# EAGLE design Lyra_Main_4_Panel (EAGLE 9.6.0)
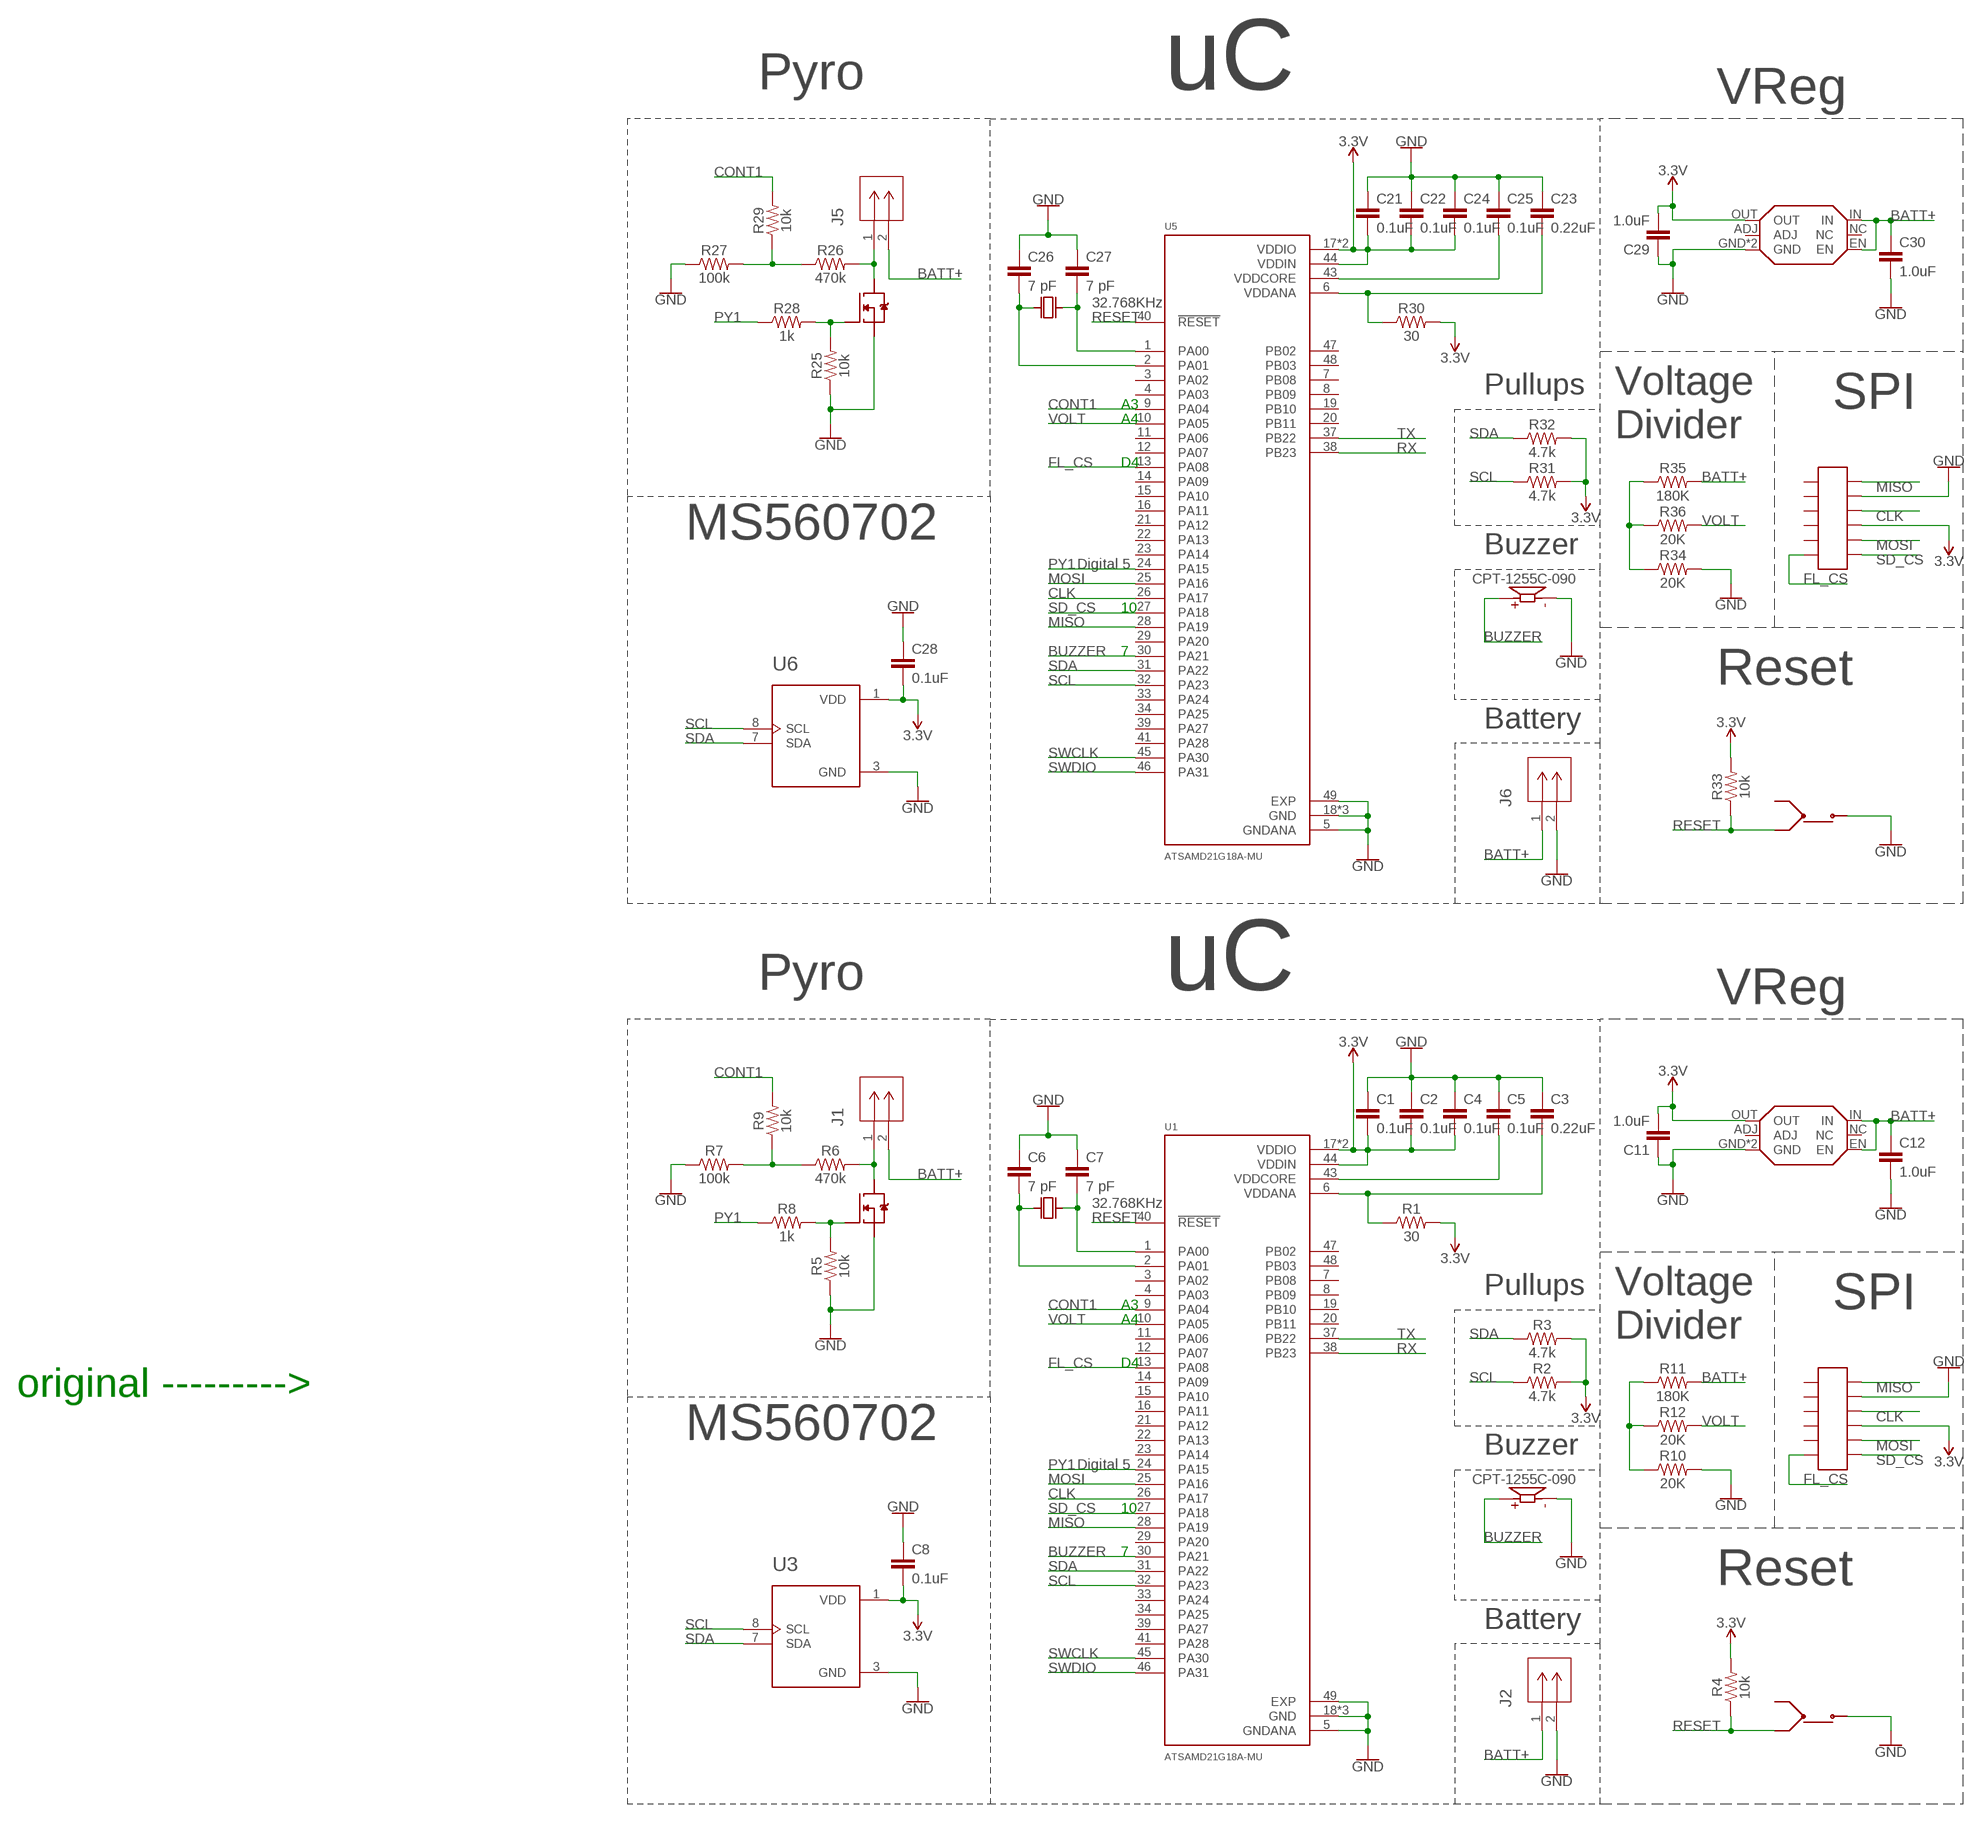
[diagram p0: schematic, sheet 1, part 1 of 2]
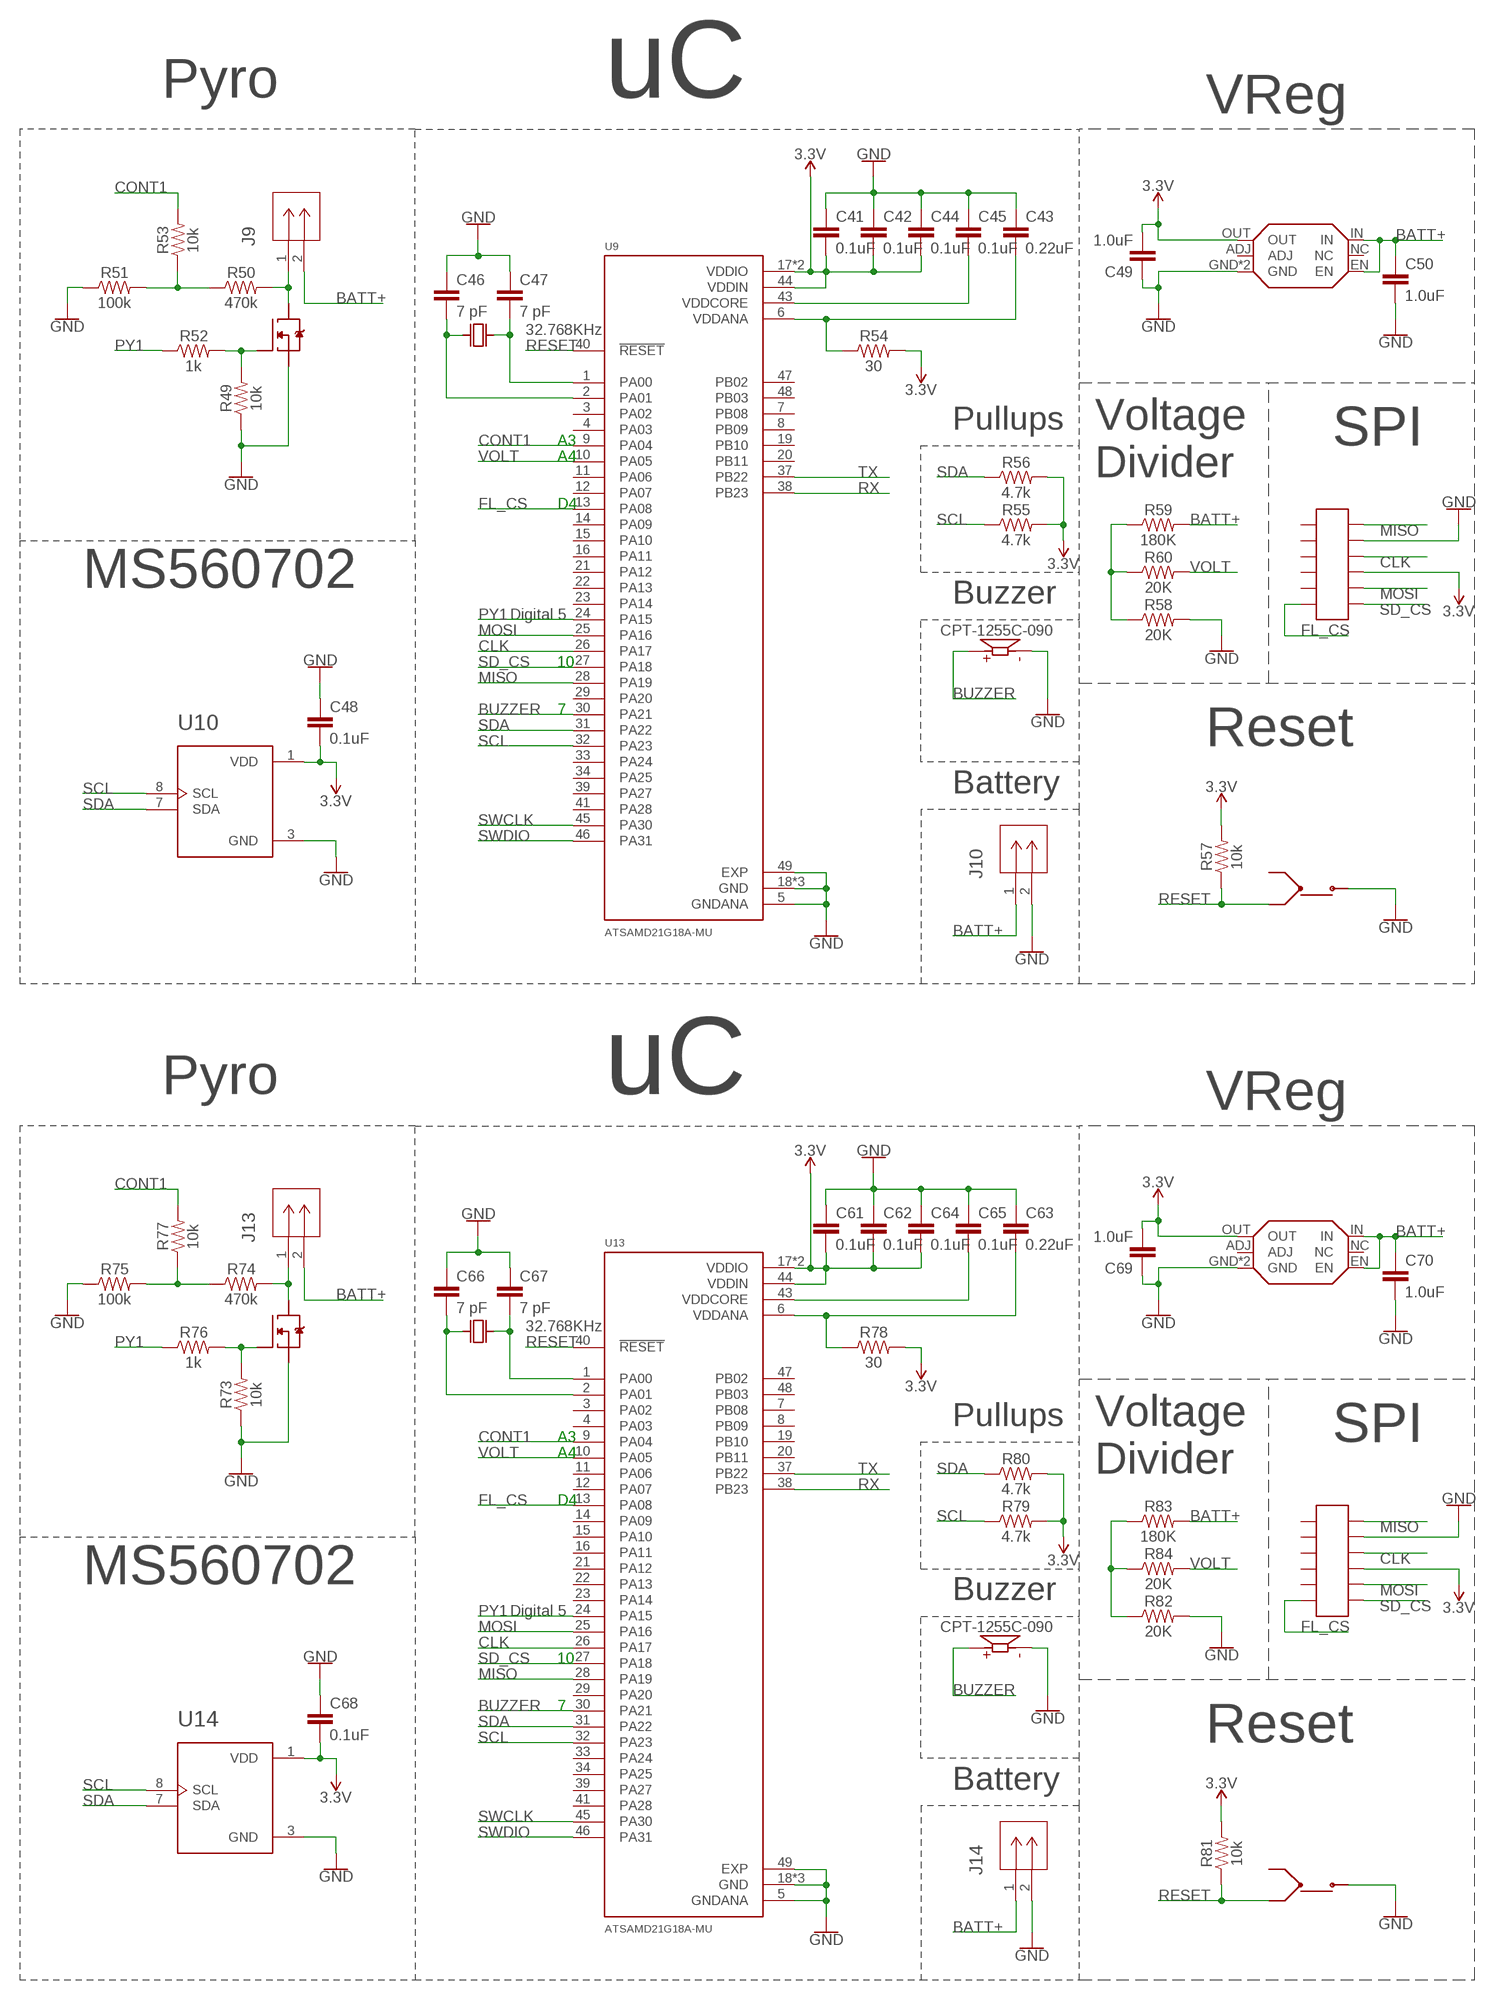
[diagram p1: schematic, sheet 1, part 2 of 2]

## Parts
C1  0.1uF  0.1UF-0603-25V-(+80/-20%)  [0603]
C2  0.1uF  0.1UF-0603-25V-(+80/-20%)  [0603]
C3  0.22uF  0.1UF-0603-25V-(+80/-20%)  [0603]
C4  0.1uF  0.1UF-0603-25V-(+80/-20%)  [0603]
C5  0.1uF  0.1UF-0603-25V-(+80/-20%)  [0603]
C6  7 pF  0.1UF-0402-16V-10%  [0402]
C7  7 pF  0.1UF-0402-16V-10%  [0402]
C8  0.1uF  0.1UF-0603-25V-(+80/-20%)  [0603]
C11  1.0uF  1.0UF-0402-16V-10%  [0402]
C12  1.0uF  1.0UF-0402-16V-10%  [0402]
C21  0.1uF  0.1UF-0603-25V-(+80/-20%)  [0603]
C22  0.1uF  0.1UF-0603-25V-(+80/-20%)  [0603]
C23  0.22uF  0.1UF-0603-25V-(+80/-20%)  [0603]
C24  0.1uF  0.1UF-0603-25V-(+80/-20%)  [0603]
C25  0.1uF  0.1UF-0603-25V-(+80/-20%)  [0603]
C26  7 pF  0.1UF-0402-16V-10%  [0402]
C27  7 pF  0.1UF-0402-16V-10%  [0402]
C28  0.1uF  0.1UF-0603-25V-(+80/-20%)  [0603]
C29  1.0uF  1.0UF-0402-16V-10%  [0402]
C30  1.0uF  1.0UF-0402-16V-10%  [0402]
C41  0.1uF  0.1UF-0603-25V-(+80/-20%)  [0603]
C42  0.1uF  0.1UF-0603-25V-(+80/-20%)  [0603]
C43  0.22uF  0.1UF-0603-25V-(+80/-20%)  [0603]
C44  0.1uF  0.1UF-0603-25V-(+80/-20%)  [0603]
C45  0.1uF  0.1UF-0603-25V-(+80/-20%)  [0603]
C46  7 pF  0.1UF-0402-16V-10%  [0402]
C47  7 pF  0.1UF-0402-16V-10%  [0402]
C48  0.1uF  0.1UF-0603-25V-(+80/-20%)  [0603]
C49  1.0uF  1.0UF-0402-16V-10%  [0402]
C50  1.0uF  1.0UF-0402-16V-10%  [0402]
C61  0.1uF  0.1UF-0603-25V-(+80/-20%)  [0603]
C62  0.1uF  0.1UF-0603-25V-(+80/-20%)  [0603]
C63  0.22uF  0.1UF-0603-25V-(+80/-20%)  [0603]
C64  0.1uF  0.1UF-0603-25V-(+80/-20%)  [0603]
C65  0.1uF  0.1UF-0603-25V-(+80/-20%)  [0603]
C66  7 pF  0.1UF-0402-16V-10%  [0402]
C67  7 pF  0.1UF-0402-16V-10%  [0402]
C68  0.1uF  0.1UF-0603-25V-(+80/-20%)  [0603]
C69  1.0uF  1.0UF-0402-16V-10%  [0402]
C70  1.0uF  1.0UF-0402-16V-10%  [0402]
J1  OSTVN02A150  [CONN_OSTVN02A150_OST]
J2  OSTVN02A150  [CONN_OSTVN02A150_OST]
J5  OSTVN02A150  [CONN_OSTVN02A150_OST]
J6  OSTVN02A150  [CONN_OSTVN02A150_OST]
J9  OSTVN02A150  [CONN_OSTVN02A150_OST]
J10  OSTVN02A150  [CONN_OSTVN02A150_OST]
J13  OSTVN02A150  [CONN_OSTVN02A150_OST]
J14  OSTVN02A150  [CONN_OSTVN02A150_OST]
LS2  CPT-1255C-090  [CUI_CPT-1255C-090]
LS3  CPT-1255C-090  [CUI_CPT-1255C-090]
LS5  CPT-1255C-090  [CUI_CPT-1255C-090]
LS7  CPT-1255C-090  [CUI_CPT-1255C-090]
R1  30  RESISTOR0402  [0402]
R2  4.7k  4.7KOHM-0603-1/10W-1%  [0603]
R3  4.7k  4.7KOHM-0603-1/10W-1%  [0603]
R4  10k  RESISTOR0402  [0402]
R5  10k  RESISTOR0402  [0402]
R6  470k  RESISTOR0402  [0402]
R7  100k  RESISTOR0402  [0402]
R8  1k  RESISTOR0402  [0402]
R9  10k  RESISTOR0402  [0402]
R10  20K  RESISTOR0402  [0402]
R11  180K  RESISTOR0402  [0402]
R12  20K  RESISTOR0402  [0402]
R25  10k  RESISTOR0402  [0402]
R26  470k  RESISTOR0402  [0402]
R27  100k  RESISTOR0402  [0402]
R28  1k  RESISTOR0402  [0402]
R29  10k  RESISTOR0402  [0402]
R30  30  RESISTOR0402  [0402]
R31  4.7k  4.7KOHM-0603-1/10W-1%  [0603]
R32  4.7k  4.7KOHM-0603-1/10W-1%  [0603]
R33  10k  RESISTOR0402  [0402]
R34  20K  RESISTOR0402  [0402]
R35  180K  RESISTOR0402  [0402]
R36  20K  RESISTOR0402  [0402]
R49  10k  RESISTOR0402  [0402]
R50  470k  RESISTOR0402  [0402]
R51  100k  RESISTOR0402  [0402]
R52  1k  RESISTOR0402  [0402]
R53  10k  RESISTOR0402  [0402]
R54  30  RESISTOR0402  [0402]
R55  4.7k  4.7KOHM-0603-1/10W-1%  [0603]
R56  4.7k  4.7KOHM-0603-1/10W-1%  [0603]
R57  10k  RESISTOR0402  [0402]
R58  20K  RESISTOR0402  [0402]
R59  180K  RESISTOR0402  [0402]
R60  20K  RESISTOR0402  [0402]
R73  10k  RESISTOR0402  [0402]
R74  470k  RESISTOR0402  [0402]
R75  100k  RESISTOR0402  [0402]
R76  1k  RESISTOR0402  [0402]
R77  10k  RESISTOR0402  [0402]
R78  30  RESISTOR0402  [0402]
R79  4.7k  4.7KOHM-0603-1/10W-1%  [0603]
R80  4.7k  4.7KOHM-0603-1/10W-1%  [0603]
R81  10k  RESISTOR0402  [0402]
R82  20K  RESISTOR0402  [0402]
R83  180K  RESISTOR0402  [0402]
R84  20K  RESISTOR0402  [0402]
U1  ATSAMD21G18A-MU  [QFN50P700X700X90-49N]
U3  MS860702BA01-50  [TE_MS860702BA01-50]
U5  ATSAMD21G18A-MU  [QFN50P700X700X90-49N]
U6  MS860702BA01-50  [TE_MS860702BA01-50]
U9  ATSAMD21G18A-MU  [QFN50P700X700X90-49N]
U10  MS860702BA01-50  [TE_MS860702BA01-50]
U13  ATSAMD21G18A-MU  [QFN50P700X700X90-49N]
U14  MS860702BA01-50  [TE_MS860702BA01-50]
U$1  32.768KHz  FC-135  [FC-135]
U$2  IRLHM630PBF  [IRLHM630PBF]
U$3  NCP718AMT330TBG  [NCP718BMT330TBG]
U$4  BUTTON  [BUTTON]
U$5  12POS_SOCKET  [12POS_SOCKET]
U$11  IRLHM630PBF  [IRLHM630PBF]
U$12  32.768KHz  FC-135  [FC-135]
U$13  NCP718AMT330TBG  [NCP718BMT330TBG]
U$14  BUTTON  [BUTTON]
U$15  12POS_SOCKET  [12POS_SOCKET]
U$21  IRLHM630PBF  [IRLHM630PBF]
U$22  32.768KHz  FC-135  [FC-135]
U$23  NCP718AMT330TBG  [NCP718BMT330TBG]
U$24  BUTTON  [BUTTON]
U$25  12POS_SOCKET  [12POS_SOCKET]
U$31  IRLHM630PBF  [IRLHM630PBF]
U$32  32.768KHz  FC-135  [FC-135]
U$33  NCP718AMT330TBG  [NCP718BMT330TBG]
U$34  BUTTON  [BUTTON]
U$35  12POS_SOCKET  [12POS_SOCKET]

## Nets
3.3V: C1.2 C2.2 C4.2 C8.2 C11.2 C21.2 C22.2 C24.2 C28.2 C29.2 C41.2 C42.2 C44.2 C48.2 C49.2 C61.2 C62.2 C64.2 C68.2 C69.2 R1.2 R2.2 R3.2 R4.2 R30.2 R31.2 R32.2 R33.2 R54.2 R55.2 R56.2 R57.2 R78.2 R79.2 R80.2 R81.2 U1.17(VDDIO) U1.36(VDDIO) U1.44(VDDIN) U3.1(VDD) U5.17(VDDIO) U5.36(VDDIO) U5.44(VDDIN) U6.1(VDD) U9.17(VDDIO) U9.36(VDDIO) U9.44(VDDIN) U10.1(VDD) U13.17(VDDIO) U13.36(VDDIO) U13.44(VDDIN) U14.1(VDD) U$3.OUT U$5.P$9 U$13.OUT U$15.P$9 U$23.OUT U$25.P$9 U$33.OUT U$35.P$9
BATT+: C12.1 C30.1 C50.1 C70.1 J1.2 J2.1 J5.2 J6.1 J9.2 J10.1 J13.2 J14.1 R11.2 R35.2 R59.2 R83.2 U$3.EN U$3.IN U$13.EN U$13.IN U$23.EN U$23.IN U$33.EN U$33.IN
BUZZER: LS2.P LS3.P LS5.P LS7.P U1.30(PA21) U5.30(PA21) U9.30(PA21) U13.30(PA21)
CLK: U1.26(PA17) U5.26(PA17) U9.26(PA17) U13.26(PA17) U$5.P$10 U$15.P$10 U$25.P$10 U$35.P$10
CONT1: R9.2 R29.2 R53.2 R77.2 U1.9(PA04) U5.9(PA04) U9.9(PA04) U13.9(PA04)
FL_CS: U1.13(PA08) U5.13(PA08) U9.13(PA08) U13.13(PA08) U$5.P$6 U$15.P$6 U$25.P$6 U$35.P$6
GND: C1.1 C2.1 C3.1 C4.1 C5.1 C6.1 C7.1 C8.1 C11.1 C12.2 C21.1 C22.1 C23.1 C24.1 C25.1 C26.1 C27.1 C28.1 C29.1 C30.2 C41.1 C42.1 C43.1 C44.1 C45.1 C46.1 C47.1 C48.1 C49.1 C50.2 C61.1 C62.1 C63.1 C64.1 C65.1 C66.1 C67.1 C68.1 C69.1 C70.2 J2.2 J6.2 J10.2 J14.2 LS2.N LS3.N LS5.N LS7.N R5.1 R7.1 R10.2 R25.1 R27.1 R34.2 R49.1 R51.1 R58.2 R73.1 R75.1 R82.2 U1.5(GNDANA) U1.18(GND) U1.35(GND) U1.42(GND) U1.49(EXP) U3.3(GND) U5.5(GNDANA) U5.18(GND) U5.35(GND) U5.42(GND) U5.49(EXP) U6.3(GND) U9.5(GNDANA) U9.18(GND) U9.35(GND) U9.42(GND) U9.49(EXP) U10.3(GND) U13.5(GNDANA) U13.18(GND) U13.35(GND) U13.42(GND) U13.49(EXP) U14.3(GND) U$2.P$2 U$2.P$3 U$2.P$4 U$3.GND U$3.P$7(GND) U$4.4(OUT) U$5.P$11 U$11.P$2 U$11.P$3 U$11.P$4 U$13.GND U$13.P$7(GND) U$14.4(OUT) U$15.P$11 U$21.P$2 U$21.P$3 U$21.P$4 U$23.GND U$23.P$7(GND) U$24.4(OUT) U$25.P$11 U$31.P$2 U$31.P$3 U$31.P$4 U$33.GND U$33.P$7(GND) U$34.4(OUT) U$35.P$11
MISO [New Class]: U1.28(PA19) U5.28(PA19) U9.28(PA19) U13.28(PA19) U$5.P$12 U$15.P$12 U$25.P$12 U$35.P$12
MOSI [New Class]: U1.25(PA16) U5.25(PA16) U9.25(PA16) U13.25(PA16) U$5.P$8 U$15.P$8 U$25.P$8 U$35.P$8
N$1: C7.2 U1.1(PA00) U$1.P$2
N$2: J1.1 R6.2 U$2.P$5 U$2.P$6 U$2.P$7 U$2.P$8 U$2.P$9
N$3: R5.2 R8.2 U$2.P$1
N$4: C6.2 U1.2(PA01) U$1.P$1
N$5: R6.1 R7.2 R9.1
N$6: R10.1 R11.1 R12.1
N$8: C5.2 U1.43(VDDCORE)
N$9: C3.2 R1.1 U1.6(VDDANA)
N$17: J5.1 R26.2 U$11.P$5 U$11.P$6 U$11.P$7 U$11.P$8 U$11.P$9
N$18: R25.2 R28.2 U$11.P$1
N$19: R26.1 R27.2 R29.1
N$20: C27.2 U5.1(PA00) U$12.P$2
N$21: C26.2 U5.2(PA01) U$12.P$1
N$22: C25.2 U5.43(VDDCORE)
N$23: C23.2 R30.1 U5.6(VDDANA)
N$24: R34.1 R35.1 R36.1
N$33: J9.1 R50.2 U$21.P$5 U$21.P$6 U$21.P$7 U$21.P$8 U$21.P$9
N$34: R49.2 R52.2 U$21.P$1
N$35: R50.1 R51.2 R53.1
N$36: C47.2 U9.1(PA00) U$22.P$2
N$37: C46.2 U9.2(PA01) U$22.P$1
N$38: C45.2 U9.43(VDDCORE)
N$39: C43.2 R54.1 U9.6(VDDANA)
N$40: R58.1 R59.1 R60.1
N$49: J13.1 R74.2 U$31.P$5 U$31.P$6 U$31.P$7 U$31.P$8 U$31.P$9
N$50: R73.2 R76.2 U$31.P$1
N$51: R74.1 R75.2 R77.1
N$52: C67.2 U13.1(PA00) U$32.P$2
N$53: C66.2 U13.2(PA01) U$32.P$1
N$54: C65.2 U13.43(VDDCORE)
N$55: C63.2 R78.1 U13.6(VDDANA)
N$56: R82.1 R83.1 R84.1
PY1: R8.1 R28.1 R52.1 R76.1 U1.24(PA15) U5.24(PA15) U9.24(PA15) U13.24(PA15)
RESET: R4.1 R33.1 R57.1 R81.1 U1.40(!RESET) U5.40(!RESET) U9.40(!RESET) U13.40(!RESET) U$4.2(IN(2)) U$14.2(IN(2)) U$24.2(IN(2)) U$34.2(IN(2))
RX: U1.38(PB23) U5.38(PB23) U9.38(PB23) U13.38(PB23)
SCL: R2.1 R31.1 R55.1 R79.1 U1.32(PA23) U3.8(SCL) U5.32(PA23) U6.8(SCL) U9.32(PA23) U10.8(SCL) U13.32(PA23) U14.8(SCL)
SD_CS [New Class]: U1.27(PA18) U5.27(PA18) U9.27(PA18) U13.27(PA18) U$5.P$7 U$15.P$7 U$25.P$7 U$35.P$7
SDA: R3.1 R32.1 R56.1 R80.1 U1.31(PA22) U3.7(SDA) U5.31(PA22) U6.7(SDA) U9.31(PA22) U10.7(SDA) U13.31(PA22) U14.7(SDA)
SWCLK: U1.45(PA30) U5.45(PA30) U9.45(PA30) U13.45(PA30)
SWDIO: U1.46(PA31) U5.46(PA31) U9.46(PA31) U13.46(PA31)
TX: U1.37(PB22) U5.37(PB22) U9.37(PB22) U13.37(PB22)
VOLT: R12.2 R36.2 R60.2 R84.2 U1.10(PA05) U5.10(PA05) U9.10(PA05) U13.10(PA05)
Unconnected: U1.3(PA02) U1.4(PA03) U1.7(PB08) U1.8(PB09) U1.11(PA06) U1.12(PA07) U1.14(PA09) U1.15(PA10) U1.16(PA11) U1.19(PB10) U1.20(PB11) U1.21(PA12) U1.22(PA13) U1.23(PA14) U1.29(PA20) U1.33(PA24) U1.34(PA25) U1.39(PA27) U1.41(PA28) U1.47(PB02) U1.48(PB03) U5.3(PA02) U5.4(PA03) U5.7(PB08) U5.8(PB09) U5.11(PA06) U5.12(PA07) U5.14(PA09) U5.15(PA10) U5.16(PA11) U5.19(PB10) U5.20(PB11) U5.21(PA12) U5.22(PA13) U5.23(PA14) U5.29(PA20) U5.33(PA24) U5.34(PA25) U5.39(PA27) U5.41(PA28) U5.47(PB02) U5.48(PB03) U9.3(PA02) U9.4(PA03) U9.7(PB08) U9.8(PB09) U9.11(PA06) U9.12(PA07) U9.14(PA09) U9.15(PA10) U9.16(PA11) U9.19(PB10) U9.20(PB11) U9.21(PA12) U9.22(PA13) U9.23(PA14) U9.29(PA20) U9.33(PA24) U9.34(PA25) U9.39(PA27) U9.41(PA28) U9.47(PB02) U9.48(PB03) U13.3(PA02) U13.4(PA03) U13.7(PB08) U13.8(PB09) U13.11(PA06) U13.12(PA07) U13.14(PA09) U13.15(PA10) U13.16(PA11) U13.19(PB10) U13.20(PB11) U13.21(PA12) U13.22(PA13) U13.23(PA14) U13.29(PA20) U13.33(PA24) U13.34(PA25) U13.39(PA27) U13.41(PA28) U13.47(PB02) U13.48(PB03) U$3.ADJ U$3.NC U$4.1(IN) U$5.P$1 U$5.P$2 U$5.P$3 U$5.P$4 U$5.P$5 U$13.ADJ U$13.NC U$14.1(IN) U$15.P$1 U$15.P$2 U$15.P$3 U$15.P$4 U$15.P$5 U$23.ADJ U$23.NC U$24.1(IN) U$25.P$1 U$25.P$2 U$25.P$3 U$25.P$4 U$25.P$5 U$33.ADJ U$33.NC U$34.1(IN) U$35.P$1 U$35.P$2 U$35.P$3 U$35.P$4 U$35.P$5

## Notes on the sheet
- Pyro | uC | VReg | Pyro | uC | VReg
- Pullups | Pullups
- A3 | SPI | A3 | SPI
- A4 | A4
- Voltage 
  Divider
- Voltage 
  Divider
- D4 | D4
- MS560702 | MS560702
- Buzzer | Buzzer
- Digital 5 | Digital 5
- 10 | 10
- 7 | 7
- Reset | Reset
- Battery | Battery
- Pyro | uC | VReg | Pyro | uC
- VReg
- Pullups
- A3 | SPI | Pullups
- A4 | A3 | SPI
- Voltage 
  Divider
- A4
- Voltage 
  Divider
- D4
- D4
- original --------->
- MS560702
- Buzzer | MS560702
- Digital 5 | Buzzer
- Digital 5
- 10
- 10
- 7
- 7
- Reset | Reset
- Battery
- Battery

## Library data of the parts
C1 C2 C4 C5 C8 C21 C22 C24 C25 C28 C41 C42 C44 C45 C48 C61 C62 C64 C65 C68 = SparkFun-Capacitors:0.1UF: 0.1µF ceramic capacitors A capacitor is a passive two-terminal electrical component used to store electrical energy temporarily in an electric field.; PROD_ID: CAP-00810
C3 C23 C43 C63 = SparkFun-Capacitors:0.1UF: 0.1µF ceramic capacitors A capacitor is a passive two-terminal electrical component used to store electrical energy temporarily in an electric field.; PROD_ID: CAP-00810; VALUE: 0.1uF
C6 C7 C26 C27 C46 C47 C66 C67 = SparkFun-Capacitors:0.1UF: 0.1µF ceramic capacitors A capacitor is a passive two-terminal electrical component used to store electrical energy temporarily in an electric field.; PROD_ID: CAP-12416; VALUE: 0.1uF
C11 C12 C29 C30 C49 C50 C69 C70 = SparkFun-Capacitors:1.0UF: 1µF ceramic capacitors A capacitor is a passive two-terminal electrical component used to store electrical energy temporarily in an electric field.; PROD_ID: CAP-12417
J1 J2 J5 J6 J9 J10 J13 J14 = 2pin2.54Terminal:OSTVN02A150; BUILT_BY: EMA_Cory; COPYRIGHT: Copyright (C) 2018 Accelerated Designs. All rights reserved; MANUFACTURER_PART_NUMBER: OSTVN02A150; SOURCELIBRARY: On_Shore_Technology_2019-12-02; VENDOR: On Shore Technology Inc
LS2 LS3 LS5 LS7 = CPT-1255C-090:CPT-1255C-090: Buzzer 12 mm, 20 Vp-p, 80 dB, Through Hole, Piezo Audio Transducer Buzzer Check prices <https://pricing.snapeda.com/parts/CPT-1255C-090/CUI%20Devices/view-part?ref=eda>; AVAILABILITY: Good; CUI_PURCHASE_URL: https://www.cuidevices.com/product/audio/buzzers/audio-transducers/cpt-1255c-090?utm_source=snapeda.com&utm_medium=referral&utm_campaign=snapedaBOM; DESCRIPTION: 12 mm, 20 Vp-p, 80 dB, Through Hole, Piezo Audio Transducer Buzzer; MF: CUI Devices; MP: CPT-1255C-090; PACKAGE: CUI Inc.; PRICE: None; PURCHASE-URL: https://pricing.snapeda.com/search/part/CPT-1255C-090/?ref=eda
R1 R4-R12 R25-R30 R33-R36 R49-R54 R57-R60 R73-R78 R81-R84 = SparkFun-Resistors:RESISTOR: Generic Resistor Package
R2 R3 R31 R32 R55 R56 R79 R80 = SparkFun-Resistors:4.7KOHM: 4.7kΩ resistor A resistor is a passive two-terminal electrical component that implements electrical resistance as a circuit element. Resistors act to reduce current flow, and, at the same time, act to lower voltage levels within circuits. - Wikipedia; PROD_ID: RES-07857
U1 U5 U9 U13 = ATSAMD21G18A-MU:ATSAMD21G18A-MU: Cortex-M0+, 256KB FLASH, 32KB SRAM, USB, DMA, T&R - 48QFN IND TEMP, GREEN, 1.6-3.6V, 48MHz/ QFN (ZA); ARROW_ELECTRONICS-PURCHASE-URL: https://snapeda.com/shop?store=Arrow+Electronics&id=590181; DESCRIPTION: ARM® Cortex®-M0+ SAM D21G Microcontroller IC 32-Bit 48MHz 256KB (256K x 8) FLASH 48-QFN (7x7); DIGI-KEY_PART_NUMBER: ATSAMD21G18A-MUTTR-ND; DIGIKEY-PURCHASE-URL: https://snapeda.com/shop?store=DigiKey&id=590181; MF: Microchip; MOUSER-PURCHASE-URL: https://snapeda.com/shop?store=Mouser&id=590181; MP: ATSAMD21G18A-MU; PACKAGE: QFN-48 Microchip
U3 U6 U10 U14 = MS860702BA01-50:MS860702BA01-50: Pressure Temp Humidity Sensor Buy Part <https://snapeda.com/parts/MS860702BA01-50/TE%20Connectivity/view-part/?ref=eda>; AVAILABILITY: Warning; COMMENT: MS860702BA01-50; DESCRIPTION: PHT SENSOR, 29PSI-10MBAR, QFN-8; EU_ROHS_COMPLIANCE: Compliant; MF: TE Connectivity; MOUSER-PURCHASE-URL: https://snapeda.com/shop?store=Mouser&id=555057; MP: MS860702BA01-50; PACKAGE: QFN-8 TE Connectivity; PRICE: None
U$1 U$12 U$22 U$32 = FC-135:FC-135
U$2 U$11 U$21 U$31 = irlhm630pbf:IRLHM630PBF
U$3 U$13 U$23 U$33 = NCP718AMT330TBG:NCP718AMT330TBG
U$4 U$14 U$24 U$34 = 4.2x3.2mm Momentary Pushbutton:BUTTON
U$5 U$15 U$25 U$35 = a4e-axe-connectors:12POS_SOCKET

## Board
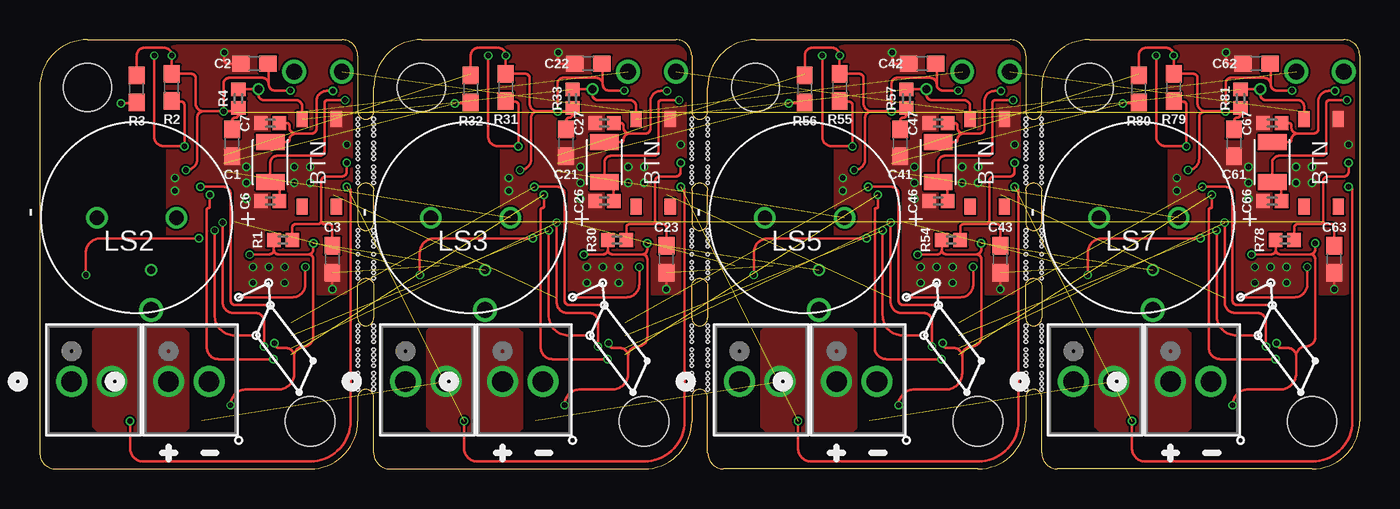
[diagram p2: board, top side]
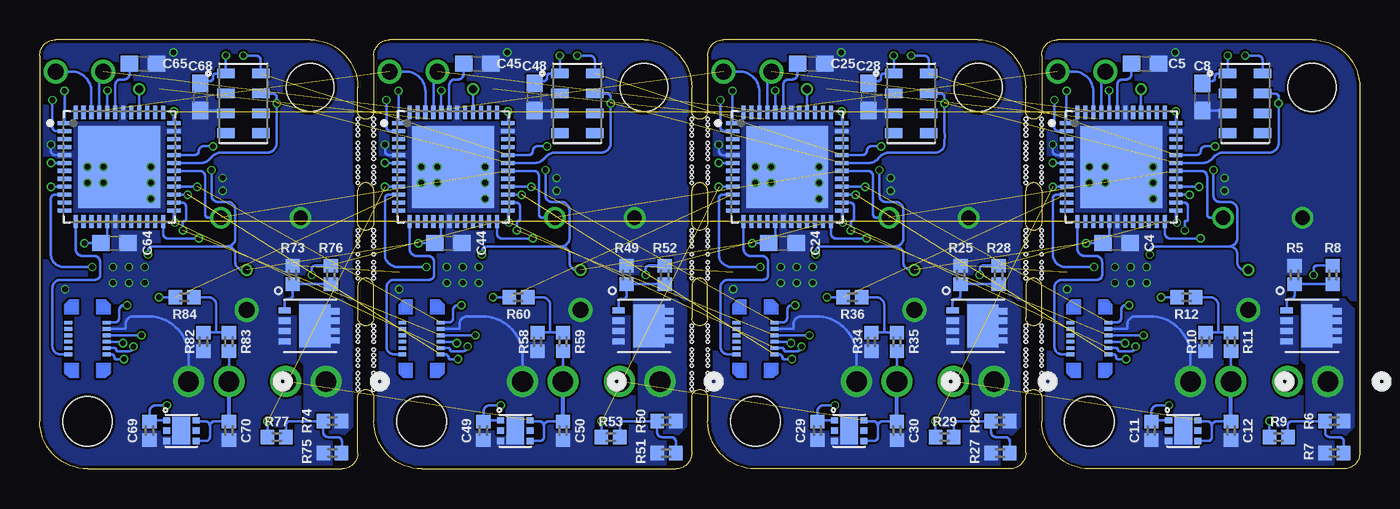
[diagram p3: board, bottom side, seen from below]

Size 83 x 27 mm. Coordinates in mm from the lower left corner, seen from the top.
Outline: 20,26 arc90 19,27 3,27 arc90 0,24 0,1 arc90 1,0 17,0 arc90 20,3 20,4.5 arc-90 20.5,5 arc-90 21,4.5 21,1 arc90 22,0 38,0 arc90 41,3 41,4.5 arc-90 41.5,5 arc-90 42,4.5 42,1 arc90 43,0 59,0 arc90 62,3 62,4.5 arc-90 62.5,5 arc-90 63,4.5 63,1 arc90 64,0 80,0 arc90 83,3 83,26 arc90 82,27 66,27 arc90 63,24 63,22.5 arc-90 62.5,22 arc-90 62,22.5 62,26 arc90 61,27 45,27 arc90 42,24 42,22.5 arc-90 41.5,22 arc-90 41,22.5 41,26 arc90 40,27 24,27 arc90 21,24 21,22.5 arc-90 20.5,22 arc-90 20,22.5 20,26
Outline: 20,9.5 arc90 20.5,9 arc90 21,9.5 21,11.5 arc90 20.5,12 arc90 20,11.5 20,9.5
Outline: 20,17.5 arc-90 20.5,18 arc-90 21,17.5 21,15.5 arc-90 20.5,15 arc-90 20,15.5 20,17.5
Outline: 41,9.5 arc90 41.5,9 arc90 42,9.5 42,11.5 arc90 41.5,12 arc90 41,11.5 41,9.5
Outline: 41,17.5 arc-90 41.5,18 arc-90 42,17.5 42,15.5 arc-90 41.5,15 arc-90 41,15.5 41,17.5
Outline: 62,9.5 arc90 62.5,9 arc90 63,9.5 63,11.5 arc90 62.5,12 arc90 62,11.5 62,9.5
Outline: 62,17.5 arc-90 62.5,18 arc-90 63,17.5 63,15.5 arc-90 62.5,15 arc-90 62,15.5 62,17.5
Copper layers (1*16): Top 0.035559375mm / dielectric 1.6mm / Bottom 0.035559375mm
Design rules "jlcpcb2layer *": minimum track width 5mil, minimum drill 12mil, track to track 5mil, track to pad 5mil, pad to pad 5mil, via to via 5mil, smd to smd 5mil, copper to edge 8mil, drill to drill 6mil, minimum pad ring 5mil, minimum via ring 3mil, stop-mask expansion 2.5mil, vias tented up to drill 15mil, thermal gap 10mil
Holes 3.1 mm at 17,3 38,3 59,3 80,3
Holes 3 mm at 3,24 24,24 45,24 66,24
Holes 0.2 mm at 20,21.33 20,21.66 20,22 20,21 21,21.67 21,21.34 21,21 21,22 20,18.33 20,18.66 20,19 20,18 21,18.67 21,18.34 21,18 21,19 20,19.83 20,20.16 20,20.5 20,19.5 21,20.17 21,19.84 21,19.5 21,20.5 20,14.33 20,14.66 20,15 20,14 21,14.67 21,14.34 21,14 21,15 20,12.33 20,12.66 20,13 20,12 21,12.67 21,12.34 21,12 21,13 20,8.33 20,8.66 20,9 20,8 21,8.67 21,8.34 21,8 21,9 20,5.33 20,5.66 20,6 20,5 21,5.67 21,5.34 21,5 21,6 20,6.83 20,7.16 20,7.5 20,6.5 21,7.17 21,6.84 21,6.5 21,7.5 20,13.5 21,13.5 41,21.33 41,21.66 41,22 41,21 42,21.67 42,21.34 42,21 42,22 41,18.33 41,18.66 41,19 41,18 42,18.67 42,18.34 42,18 42,19 41,19.83 41,20.16 41,20.5 41,19.5 42,20.17 42,19.84 42,19.5 42,20.5 41,14.33 41,14.66 41,15 41,14 42,14.67 42,14.34 42,14 42,15 41,12.33 41,12.66 41,13 41,12 42,12.67 42,12.34 42,12 42,13 41,8.33 41,8.66 41,9 41,8 42,8.67 42,8.34 42,8 42,9 41,5.33 41,5.66 41,6 41,5 42,5.67 42,5.34 42,5 42,6 41,6.83 41,7.16 41,7.5 41,6.5 42,7.17 42,6.84 42,6.5 42,7.5 41,13.5 42,13.5 62,21.33 62,21.66 62,22 62,21 63,21.67 63,21.34 63,21 63,22 62,18.33 62,18.66 62,19 62,18 63,18.67 63,18.34 63,18 63,19 62,19.83 62,20.16 62,20.5 62,19.5 63,20.17 63,19.84 63,19.5 63,20.5 62,14.33 62,14.66 62,15 62,14 63,14.67 63,14.34 63,14 63,15 62,12.33 62,12.66 62,13 62,12 63,12.67 63,12.34 63,12 63,13 62,8.33 62,8.66 62,9 62,8 63,8.67 63,8.34 63,8 63,9 62,5.33 62,5.66 62,6 62,5 63,5.67 63,5.34 63,5 63,6 62,6.83 62,7.16 62,7.5 62,6.5 63,7.17 63,6.84 63,6.5 63,7.5 62,13.5 63,13.5

### Footprints (pad centres in the part's own frame; a part is rotated, then mirrored left to right if it is on the bottom)
0603 = smd 1.1 x 1: 1 -0.85,0; 2 0.85,0
0402 = smd 0.85 x 0.9: 1 -0.58,0; 2 0.58,0
CONN_OSTVN02A150_OST = drill 1.295 pad 1.803: 1 0,0; 2 2.54,0
CUI_CPT-1255C-090 = drill 0.9: N 2.5,0; P -2.5,0
QFN50P700X700X90-49N = smd 0.84 x 0.26: 1 -3.435,2.75; 2 -3.435,2.25; 3 -3.435,1.75; 4 -3.435,1.25; 5 -3.435,0.75; 6 -3.435,0.25; 7 -3.435,-0.25; 8 -3.435,-0.75; 9 -3.435,-1.25; 10 -3.435,-1.75; 11 -3.435,-2.25; 12 -3.435,-2.75; 25 3.435,-2.75; 26 3.435,-2.25; 27 3.435,-1.75; 28 3.435,-1.25; 29 3.435,-0.75; 30 3.435,-0.25; 31 3.435,0.25; 32 3.435,0.75; 33 3.435,1.25; 34 3.435,1.75; 35 3.435,2.25; 36 3.435,2.75 | smd 0.26 x 0.84: 13 -2.75,-3.435; 14 -2.25,-3.435; 15 -1.75,-3.435; 16 -1.25,-3.435; 17 -0.75,-3.435; 18 -0.25,-3.435; 19 0.25,-3.435; 20 0.75,-3.435; 21 1.25,-3.435; 22 1.75,-3.435; 23 2.25,-3.435; 24 2.75,-3.435; 37 2.75,3.435; 38 2.25,3.435; 39 1.75,3.435; 40 1.25,3.435; 41 0.75,3.435; 42 0.25,3.435; 43 -0.25,3.435; 44 -0.75,3.435; 45 -1.25,3.435; 46 -1.75,3.435; 47 -2.25,3.435; 48 -2.75,3.435 | smd 5.15 x 5.15: 49 0,0
TE_MS860702BA01-50 = smd 1.1 x 0.6: 1 -1.1,1.875; 2 -1.1,0.625; 3 -1.1,-0.625; 4 -1.1,-1.875; 5 1.1,-1.875; 6 1.1,-0.625; 7 1.1,0.625; 8 1.1,1.875
FC-135 = smd 1 x 1.8: P$1 -1.25,0; P$2 1.25,0
IRLHM630PBF = smd 0.39 x 0.77: P$1 0.975,1.6; P$2 0.325,1.6; P$3 -0.325,1.6; P$4 -0.975,1.6 | smd 2.7 x 1.96: P$5 0,-0.3 | smd 0.39 x 0.58: P$6 -0.925,-1.57; P$7 -0.325,-1.57; P$8 0.325,-1.57; P$9 0.925,-1.57
NCP718BMT330TBG = smd 0.45 x 0.4: ADJ -0.925,0; EN 0.925,-0.65; GND -0.925,-0.65; IN 0.925,0.65; NC 0.925,0; OUT -0.925,0.65 | smd 1.12 x 1.72: P$7 0,0
BUTTON = smd 1 x 0.7: 1 0.5,2.5; 2 6,2.5; 3 0.5,0.35; 4 6,0.35
12POS_SOCKET = smd 0.5 x 0.23: P$1 -1.2,1.2; P$2 -1.2,0.8; P$3 -1.2,0.4; P$4 -1.2,0; P$5 -1.2,-0.4; P$6 -1.2,-0.8; P$7 1.2,-0.8; P$8 1.2,-0.4; P$9 1.2,0; P$10 1.2,0.4; P$11 1.2,0.8; P$12 1.2,1.2

### Placement (x,y rotation side)
C1  12.1,20.5 90 top
C2  13.5,25.5 0 top
C3  18.4,13.2 90 top
C4  15.3,14.2 180 bottom
C5  13.5,25.5 180 bottom
C6  14.5,16.85 0 top
C7  14.5,21.75 0 top
C8  9.9,23.4 90 bottom
C11  13.1,2.4 90 bottom
C12  8.1,2.4 270 bottom
C21  33.1,20.5 90 top
C22  34.5,25.5 0 top
C23  39.4,13.2 90 top
C24  36.3,14.2 180 bottom
C25  34.5,25.5 180 bottom
C26  35.5,16.85 0 top
C27  35.5,21.75 0 top
C28  30.9,23.4 90 bottom
C29  34.1,2.4 90 bottom
C30  29.1,2.4 270 bottom
C41  54.1,20.5 90 top
C42  55.5,25.5 0 top
C43  60.4,13.2 90 top
C44  57.3,14.2 180 bottom
C45  55.5,25.5 180 bottom
C46  56.5,16.85 0 top
C47  56.5,21.75 0 top
C48  51.9,23.4 90 bottom
C49  55.1,2.4 90 bottom
C50  50.1,2.4 270 bottom
C61  75.1,20.5 90 top
C62  76.5,25.5 0 top
C63  81.4,13.2 90 top
C64  78.3,14.2 180 bottom
C65  76.5,25.5 180 bottom
C66  77.5,16.85 0 top
C67  77.5,21.75 0 top
C68  72.9,23.4 90 bottom
C69  76.1,2.4 90 bottom
C70  71.1,2.4 270 bottom
J1  2,5.5 0 top
J2  8.1,5.5 0 top
J5  23,5.5 0 top
J6  29.1,5.5 0 top
J9  44,5.5 0 top
J10  50.1,5.5 0 top
J13  65,5.5 0 top
J14  71.1,5.5 0 top
LS2  6.1,15.8 180 top
LS3  27.1,15.8 180 top
LS5  48.1,15.8 180 top
LS7  69.1,15.8 180 top
R1  15.3,14.4 180 top
R2  8.3,24 90 top
R3  6.1,23.9 90 top
R4  12.5,23.3 270 top
R5  4.1,12.2 270 bottom
R6  1.6,3 0 bottom
R7  1.6,1 0 bottom
R8  1.7,12.2 270 bottom
R9  5.1,2 180 bottom
R10  9.7,8 270 bottom
R11  8.1,8 270 bottom
R12  10.9,10.8 180 bottom
R25  25.1,12.2 270 bottom
R26  22.6,3 0 bottom
R27  22.6,1 0 bottom
R28  22.7,12.2 270 bottom
R29  26.1,2 180 bottom
R30  36.3,14.4 180 top
R31  29.3,24 90 top
R32  27.1,23.9 90 top
R33  33.5,23.3 270 top
R34  30.7,8 270 bottom
R35  29.1,8 270 bottom
R36  31.9,10.8 180 bottom
R49  46.1,12.2 270 bottom
R50  43.6,3 0 bottom
R51  43.6,1 0 bottom
R52  43.7,12.2 270 bottom
R53  47.1,2 180 bottom
R54  57.3,14.4 180 top
R55  50.3,24 90 top
R56  48.1,23.9 90 top
R57  54.5,23.3 270 top
R58  51.7,8 270 bottom
R59  50.1,8 270 bottom
R60  52.9,10.8 180 bottom
R73  67.1,12.2 270 bottom
R74  64.6,3 0 bottom
R75  64.6,1 0 bottom
R76  64.7,12.2 270 bottom
R77  68.1,2 180 bottom
R78  78.3,14.4 180 top
R79  71.3,24 90 top
R80  69.1,23.9 90 top
R81  75.5,23.3 270 top
R82  72.7,8 270 bottom
R83  71.1,8 270 bottom
R84  73.9,10.8 180 bottom
U1  15,19 0 bottom
U3  7.2,23 0 bottom
U5  36,19 0 bottom
U6  28.2,23 0 bottom
U9  57,19 0 bottom
U10  49.2,23 0 bottom
U13  78,19 0 bottom
U14  70.2,23 0 bottom
U$1  14.5,19.3 90 top
U$2  3,9 90 bottom
U$3  11.1,2.4 0 bottom
U$4  19,16 90 top
U$5  17,8 0 bottom
U$11  24,9 90 bottom
U$12  35.5,19.3 90 top
U$13  32.1,2.4 0 bottom
U$14  40,16 90 top
U$15  38,8 0 bottom
U$21  45,9 90 bottom
U$22  56.5,19.3 90 top
U$23  53.1,2.4 0 bottom
U$24  61,16 90 top
U$25  59,8 0 bottom
U$31  66,9 90 bottom
U$32  77.5,19.3 90 top
U$33  74.1,2.4 0 bottom
U$34  82,16 90 top
U$35  80,8 0 bottom

### Tracks (layer width: path | path; a pad name or v marks a point on that pad's centre or on a via)
3.3V  (via drill 0.35, 0.5)  (3 unrouted)
  Top 0.152: 16,7.1 16,6 arc-90 15,5 13,5 arc90 v12,4 | 16,7.1 arc-90 16.6,7.7 arc90 17.2,8.3 17.2,13.2 arc90 16.9,13.5 | 14.4,24.2 arc90 14.8,23.8 v15.75,23.8 | 14.4,24.2 14.4,25.45 arc90 C2.2 | v11.56,22.5 arc-90 11.59,22.52 12.4,22.52 12.5,22.62 R4.2 12.5,22.3 arc-90 12.3,22.1 arc90 12.1,21.9 C1.2 | 14.4,24.2 arc90 14,24.6 11.9,24.6 arc90 11.56,24.27 v11.56,22.5 | R3.2 6.1,26 arc-90 6.6,26.5 7.8,26.5 arc-90 v8.3,26 R2.2 9.55,24.85 arc-90 9.8,24.6 9.8,23 arc90 10.3,22.5 | 10.3,22.5 v11.56,22.5 | 10.3,22.5 arc90 9.9,22.1 9.9,19.5 arc-90 v9.2,18.8 | R1.2 14.72,13.78 | 14.72,13.78 arc90 15,13.5 16.9,13.5 | 16.9,13.5 arc90 17.2,13.8 v17.2,14.2 | 14.72,13.78 arc-90 14.44,13.5 13.22,13.5 arc90 v13.2,13.48 | 16,7.1 arc90 15.5,7.6 15.06,7.6 arc-90 v14.77,7.9 | 37,7.1 37,6 arc-90 36,5 34,5 arc90 v33,4 | 37,7.1 arc-90 37.6,7.7 arc90 38.2,8.3 38.2,13.2 arc90 37.9,13.5 | 35.4,24.2 arc90 35.8,23.8 v36.75,23.8 | 35.4,24.2 35.4,25.45 arc90 C22.2 | v32.56,22.5 arc-90 32.59,22.52 33.4,22.52 33.5,22.62 R33.2 33.5,22.3 arc-90 33.3,22.1 arc90 33.1,21.9 C21.2 | 35.4,24.2 arc90 35,24.6 32.9,24.6 arc90 32.56,24.27 v32.56,22.5 | R32.2 27.1,26 arc-90 27.6,26.5 28.8,26.5 arc-90 v29.3,26 R31.2 30.55,24.85 arc-90 30.8,24.6 30.8,23 arc90 31.3,22.5 | 31.3,22.5 v32.56,22.5 | 31.3,22.5 arc90 30.9,22.1 30.9,19.5 arc-90 v30.2,18.8 | R30.2 35.72,13.78 | 35.72,13.78 arc90 36,13.5 37.9,13.5 | 37.9,13.5 arc90 38.2,13.8 v38.2,14.2 | 35.72,13.78 arc-90 35.44,13.5 34.22,13.5 arc90 v34.2,13.48 | 37,7.1 arc90 36.5,7.6 36.06,7.6 arc-90 v35.77,7.9 | 58,7.1 58,6 arc-90 57,5 55,5 arc90 v54,4 | 58,7.1 arc-90 58.6,7.7 arc90 59.2,8.3 59.2,13.2 arc90 58.9,13.5
  Top 0.152: 56.4,24.2 arc90 56.8,23.8 v57.75,23.8 | 56.4,24.2 56.4,25.45 arc90 C42.2 | v53.56,22.5 arc-90 53.59,22.52 54.4,22.52 54.5,22.62 R57.2 54.5,22.3 arc-90 54.3,22.1 arc90 54.1,21.9 C41.2 | 56.4,24.2 arc90 56,24.6 53.9,24.6 arc90 53.56,24.27 v53.56,22.5 | R56.2 48.1,26 arc-90 48.6,26.5 49.8,26.5 arc-90 v50.3,26 R55.2 51.55,24.85 arc-90 51.8,24.6 51.8,23 arc90 52.3,22.5 | 52.3,22.5 v53.56,22.5 | 52.3,22.5 arc90 51.9,22.1 51.9,19.5 arc-90 v51.2,18.8 | R54.2 56.72,13.78 | 56.72,13.78 arc90 57,13.5 58.9,13.5 | 58.9,13.5 arc90 59.2,13.8 v59.2,14.2 | 56.72,13.78 arc-90 56.44,13.5 55.22,13.5 arc90 v55.2,13.48 | 58,7.1 arc90 57.5,7.6 57.06,7.6 arc-90 v56.77,7.9 | 79,7.1 79,6 arc-90 78,5 76,5 arc90 v75,4 | 79,7.1 arc-90 79.6,7.7 arc90 80.2,8.3 80.2,13.2 arc90 79.9,13.5 | 77.4,24.2 arc90 77.8,23.8 v78.75,23.8 | 77.4,24.2 77.4,25.45 arc90 C62.2 | v74.56,22.5 arc-90 74.58,22.52 75.4,22.52 75.5,22.62 R81.2 75.5,22.3 arc-90 75.3,22.1 arc90 75.1,21.9 C61.2 | 77.4,24.2 arc90 77,24.6 74.9,24.6 arc90 74.56,24.27 v74.56,22.5 | R80.2 69.1,26 arc-90 69.6,26.5 70.8,26.5 arc-90 v71.3,26 R79.2 72.55,24.85 arc-90 72.8,24.6 72.8,23 arc90 73.3,22.5 | 73.3,22.5 v74.56,22.5 | 73.3,22.5 arc90 72.9,22.1 72.9,19.5 arc-90 v72.2,18.8 | R78.2 77.72,13.78 | 77.72,13.78 arc90 78,13.5 79.9,13.5 | 79.9,13.5 arc90 80.2,13.8 v80.2,14.2 | 77.72,13.78 arc-90 77.44,13.5 76.22,13.5 arc90 v76.2,13.48 | 79,7.1 arc90 78.5,7.6 78.06,7.6 arc-90 v77.77,7.9
  Bottom 0.152: U1.17 15.75,14.66 arc82 C4.2 v17.2,14.2 | C8.2 arc-90 9.75,24.4 9.3,24.4 arc-90 9.1,24.6 9.1,24.7 arc90 8.93,24.88 U3.1 v8.3,26 | U1.44 v15.75,23.8 | U1.36 v11.56,22.5 | 8.2,14 arc-90 7.7,14.5 7.7,16.3 arc-90 8.2,16.8 8.8,16.8 arc90 9.2,17.2 v9.2,18.8 | 8.2,14 12.9,14 arc-90 13.2,13.7 v13.2,13.48 | C11.2 13.1,3 | 13.1,3 13.1,3.6 arc90 12.7,4 v12,4 | U$5.P$9 14.87,8 arc90 v14.77,7.9 | U$3.OUT 13.05,3.05 arc-90 13.1,3 | 8.2,14 arc90 7.7,13.5 7.7,13 arc-90 7.2,12.5 v7,12.5 | U5.17 36.75,14.66 arc82 C24.2 v38.2,14.2 | C28.2 arc-90 30.75,24.4 30.3,24.4 arc-90 30.1,24.6 30.1,24.7 arc90 29.93,24.88 U6.1 v29.3,26 | U5.44 v36.75,23.8 | U5.36 v32.56,22.5 | 29.2,14 arc-90 28.7,14.5 28.7,16.3 arc-90 29.2,16.8 29.8,16.8 arc90 30.2,17.2 v30.2,18.8 | 29.2,14 33.9,14 arc-90 34.2,13.7 v34.2,13.48 | C29.2 34.1,3 | 34.1,3 34.1,3.6 arc90 33.7,4 v33,4 | U$15.P$9 35.87,8 arc90 v35.77,7.9 | U$13.OUT 34.05,3.05 arc-90 34.1,3 | 29.2,14 arc90 28.7,13.5 28.7,13 arc-90 28.2,12.5 v28,12.5 | U9.17 57.75,14.66 arc82 C44.2 v59.2,14.2 | C48.2 arc-90 51.75,24.4 51.3,24.4 arc-90 51.1,24.6 51.1,24.7 arc90 50.92,24.88 U10.1 v50.3,26 | U9.44 v57.75,23.8 | U9.36 v53.56,22.5 | 50.2,14 arc-90 49.7,14.5 49.7,16.3 arc-90 50.2,16.8 50.8,16.8 arc90 51.2,17.2 v51.2,18.8 | 50.2,14 54.9,14 arc-90 55.2,13.7 v55.2,13.48 | C49.2 55.1,3 | 55.1,3 55.1,3.6 arc90 54.7,4 v54,4 | U$25.P$9 56.87,8 arc90 v56.77,7.9 | U$23.OUT 55.05,3.05 arc-90 55.1,3 | 50.2,14 arc90 49.7,13.5 49.7,13 arc-90 49.2,12.5 v49,12.5 | U13.17 78.75,14.66 arc82 C64.2 v80.2,14.2 | C68.2 arc-90 72.75,24.4 72.3,24.4 arc-90 72.1,24.6 72.1,24.7 arc90 71.92,24.88 U14.1 v71.3,26
  Bottom 0.152: U13.44 v78.75,23.8 | U13.36 v74.56,22.5 | 71.2,14 arc-90 70.7,14.5 70.7,16.3 arc-90 71.2,16.8 71.8,16.8 arc90 72.2,17.2 v72.2,18.8 | 71.2,14 75.9,14 arc-90 76.2,13.7 v76.2,13.48 | C69.2 76.1,3 | 76.1,3 76.1,3.6 arc90 75.7,4 v75,4 | U$35.P$9 77.86,8 arc90 v77.77,7.9 | U$33.OUT 76.05,3.05 arc-90 76.1,3 | 71.2,14 arc90 70.7,13.5 70.7,13 arc-90 70.2,12.5 v70,12.5
BATT+  (3 unrouted)
  Bottom 0.152: 8.17,3.05 C12.1 9.02,2.98 arc-90 9.3,2.7 | R11.2 J2.1 | U$3.EN 9.55,1.75 arc-90 9.3,2 9.3,2.7 | 9.3,2.7 arc-90 9.6,3 10.12,3 arc90 U$3.IN | 29.17,3.05 C30.1 30.02,2.98 arc-90 30.3,2.7 | R35.2 J6.1 | U$13.EN 30.55,1.75 arc-90 30.3,2 30.3,2.7 | 30.3,2.7 arc-90 30.6,3 31.12,3 arc90 U$13.IN | 50.17,3.05 C50.1 51.02,2.98 arc-90 51.3,2.7 | R59.2 J10.1 | U$23.EN 51.55,1.75 arc-90 51.3,2 51.3,2.7 | 51.3,2.7 arc-90 51.6,3 52.12,3 arc90 U$23.IN | 71.17,3.05 C70.1 72.02,2.98 arc-90 72.3,2.7 | R83.2 J14.1 | U$33.EN 72.55,1.75 arc-90 72.3,2 72.3,2.7 | 72.3,2.7 arc-90 72.6,3 73.12,3 arc90 U$33.IN
  Bottom 0.254: C12.1 J2.1 | C30.1 J6.1 | C50.1 J10.1 | C70.1 J14.1
  pour Top (no thermals): 3.4,8.6 3.4,2.7 3.9,2.2 8.9,2.2 9.3,2.6 9.3,8.5 8.9,8.9 3.7,8.9
  pour Top (no thermals): 24.4,8.6 24.4,2.7 24.9,2.2 29.9,2.2 30.3,2.6 30.3,8.5 29.9,8.9 24.7,8.9
  pour Top (no thermals): 45.4,8.6 45.4,2.7 45.9,2.2 50.9,2.2 51.3,2.6 51.3,8.5 50.9,8.9 45.7,8.9
  pour Top (no thermals): 66.4,8.6 66.4,2.7 66.9,2.2 71.9,2.2 72.3,2.6 72.3,8.5 71.9,8.9 66.7,8.9
BUZZER  (3 unrouted)
  Bottom 0.152: LS2.P 9.4,15.8 arc90 9.6,16 9.6,18.4 arc-90 9.95,18.75 U1.30 | LS3.P 30.4,15.8 arc90 30.6,16 30.6,18.4 arc-90 30.95,18.75 U5.30 | LS5.P 51.4,15.8 arc90 51.6,16 51.6,18.4 arc-90 51.95,18.75 U9.30 | LS7.P 72.4,15.8 arc90 72.6,16 72.6,18.4 arc-90 72.95,18.75 U13.30
CLK  (via drill 0.35)  (3 unrouted)
  Top 0.152: v11,15 11,9.68 arc91 12.25,8.4 v13.6,8.4 | v32,15 32,9.68 arc91 33.25,8.4 v34.6,8.4 | v53,15 53,9.68 arc91 54.25,8.4 v55.6,8.4 | v74,15 74,9.68 arc91 75.25,8.4 v76.6,8.4
  Bottom 0.152: v11,15 11,15.5 arc90 10.9,15.6 arc-90 10.8,15.7 10.8,16.5 arc-90 11.05,16.75 U1.26 | v13.6,8.4 U$5.P$10 | v32,15 32,15.5 arc90 31.9,15.6 arc-90 31.8,15.7 31.8,16.5 arc-90 32.05,16.75 U5.26 | v34.6,8.4 U$15.P$10 | v53,15 53,15.5 arc90 52.9,15.6 arc-90 52.8,15.7 52.8,16.5 arc-90 53.05,16.75 U9.26 | v55.6,8.4 U$25.P$10 | v74,15 74,15.5 arc90 73.9,15.6 arc-90 73.8,15.7 73.8,16.5 arc-90 74.05,16.75 U13.26 | v76.6,8.4 U$35.P$10
CONT1  (via drill 0.35)  (3 unrouted)
  Top 0.152: v19.3,17.75 arc-90 19.54,17.51 19.54,3 arc-90 17,0.46 6.54,0.46 arc-90 5.68,1.3 v5.68,3 | v40.3,17.75 arc-90 40.54,17.51 40.54,3 arc-90 38,0.46 27.54,0.46 arc-90 26.68,1.3 v26.68,3 | v61.3,17.75 arc-90 61.54,17.51 61.54,3 arc-90 59,0.46 48.54,0.46 arc-90 47.68,1.3 v47.68,3 | v82.3,17.75 arc-90 82.54,17.51 82.54,3 arc-90 80,0.46 69.54,0.46 arc-90 68.68,1.3 v68.68,3
  Bottom 0.152: U1.9 v19.3,17.75 | R9.2 v5.68,3 | U5.9 v40.3,17.75 | R29.2 v26.68,3 | U9.9 v61.3,17.75 | R53.2 v47.68,3 | U13.9 v82.3,17.75 | R77.2 v68.68,3
FL_CS  (3 unrouted)
  Bottom 0.152: U1.13 17.75,13.85 arc-90 17.3,13.4 16.6,13.4 arc90 16.2,13 16.2,12.2 arc90 16.5,11.9 18.7,11.9 arc-90 19.2,11.4 19.2,7.7 arc-90 18.7,7.2 U$5.P$6 | U5.13 38.75,13.85 arc-90 38.3,13.4 37.6,13.4 arc90 37.2,13 37.2,12.2 arc90 37.5,11.9 39.7,11.9 arc-90 40.2,11.4 40.2,7.7 arc-90 39.7,7.2 U$15.P$6 | U9.13 59.75,13.85 arc-90 59.3,13.4 58.6,13.4 arc90 58.2,13 58.2,12.2 arc90 58.5,11.9 60.7,11.9 arc-90 61.2,11.4 61.2,7.7 arc-90 60.7,7.2 U$25.P$6 | U13.13 80.75,13.85 arc-90 80.3,13.4 79.6,13.4 arc90 79.2,13 79.2,12.2 arc90 79.5,11.9 81.7,11.9 arc-90 82.2,11.4 82.2,7.7 arc-90 81.7,7.2 U$35.P$6
GND  (via drill 0.35, 1)  (3 unrouted)
  Top 0.152: C5.1 11.8,25.5 arc-90 11.6,25.7 v11.6,26.2 | C3.1 v18.4,11.3 | C25.1 32.8,25.5 arc-90 32.6,25.7 v32.6,26.2 | C23.1 v39.4,11.3 | C45.1 53.8,25.5 arc-90 53.6,25.7 v53.6,26.2 | C43.1 v60.4,11.3 | C65.1 74.8,25.5 arc-90 74.6,25.7 v74.6,26.2 | C63.1 v81.4,11.3
  Bottom 0.152: U1.49 v16,18 | U1.5 19.05,19.75 arc90 19.3,20 v19.3,20.4 | U3.3 arc-90 8.47,22.55 | U3.3 arc-90 8.47,22.55 | U3.3 arc-90 8.47,22.55 | 8.47,22.55 C8.1 | U$5.P$11 14.7,8.8 arc-90 14.6,8.9 14.6,9.1 arc90 14.1,9.6 13.18,9.6 arc90 10.64,7.06 J2.2 | U5.49 v37,18 | U5.5 40.05,19.75 arc90 40.3,20 v40.3,20.4 | U6.3 arc-90 29.48,22.55 | U6.3 arc-90 29.48,22.55 | U6.3 arc-90 29.48,22.55 | 29.48,22.55 C28.1 | U$15.P$11 35.7,8.8 arc-90 35.6,8.9 35.6,9.1 arc90 35.1,9.6 34.18,9.6 arc90 31.64,7.06 J6.2 | U9.49 v58,18 | U9.5 61.05,19.75 arc90 61.3,20 v61.3,20.4 | U10.3 arc-90 50.48,22.55 | U10.3 arc-90 50.48,22.55 | U10.3 arc-90 50.48,22.55 | 50.48,22.55 C48.1 | U$25.P$11 56.7,8.8 arc-90 56.6,8.9 56.6,9.1 arc90 56.1,9.6 55.18,9.6 arc90 52.64,7.06 J10.2 | U13.49 v79,18 | U13.5 82.05,19.75 arc90 82.3,20 v82.3,20.4 | U14.3 arc-90 71.47,22.55 | U14.3 arc-90 71.47,22.55 | U14.3 arc-90 71.47,22.55 | 71.47,22.55 C68.1 | U$35.P$11 77.7,8.8 arc-90 77.6,8.9 77.6,9.1 arc90 77.1,9.6 76.18,9.6 arc90 73.64,7.06 J14.2
  other vias: 7,10 13,17 13,18 13,19 16,19 17,19 17,18 13.4,11.7 14.4,12.7 14.4,11.7 15.4,12.7 15.4,11.7 8.5,18.3 8.5,17.5 13.4,12.7 28,10 34,17 34,18 34,19 37,19 38,19 38,18 34.4,11.7 35.4,12.7 35.4,11.7 36.4,12.7 36.4,11.7 29.5,18.3 29.5,17.5 34.4,12.7 49,10 55,17 55,18 55,19 58,19 59,19 59,18 55.4,11.7 56.4,12.7 56.4,11.7 57.4,12.7 57.4,11.7 50.5,18.3 50.5,17.5 55.4,12.7 70,10 76,17 76,18 76,19 79,19 80,19 80,18 76.4,11.7 77.4,12.7 77.4,11.7 78.4,12.7 78.4,11.7 71.5,18.3 71.5,17.5 76.4,12.7
  pour Bottom (rank 2, no thermals): 1,0 17,0 arc90 20,3 20,27 3,27 arc90 0,24 0,1 arc90
  pour Top (no thermals): 19,11 8.4,11 arc-90 8,11.4 8,26 arc-90 8.61,26.61 18.98,26.61 arc-90 19.62,25.97 19.62,11.62 arc-90
  pour Bottom (rank 2, no thermals): 22,0 38,0 arc90 41,3 41,27 24,27 arc90 21,24 21,1 arc90
  pour Top (no thermals): 40,11 29.4,11 arc-90 29,11.4 29,26 arc-90 29.61,26.61 39.98,26.61 arc-90 40.62,25.97 40.62,11.62 arc-90
  pour Bottom (rank 2, no thermals): 43,0 59,0 arc90 62,3 62,27 45,27 arc90 42,24 42,1 arc90
  pour Top (no thermals): 61,11 50.4,11 arc-90 50,11.4 50,26 arc-90 50.61,26.61 60.98,26.61 arc-90 61.62,25.97 61.62,11.62 arc-90
  pour Bottom (rank 2, no thermals): 64,0 80,0 arc90 83,3 83,27 66,27 arc90 63,24 63,1 arc90
  pour Top (no thermals): 82,11 71.4,11 arc-90 71,11.4 71,26 arc-90 71.61,26.61 81.98,26.61 arc-90 82.62,25.97 82.62,11.62 arc-90
MISO  (via drill 0.35)  (3 unrouted)
  Top 0.152: v10.1,17.75 11.55,17.75 arc-90 12,17.3 12,10.6 arc90 12.3,10.3 v14.5,10.3 | v31.1,17.75 32.55,17.75 arc-90 33,17.3 33,10.6 arc90 33.3,10.3 v35.5,10.3 | v52.1,17.75 53.55,17.75 arc-90 54,17.3 54,10.6 arc90 54.3,10.3 v56.5,10.3 | v73.1,17.75 74.55,17.75 arc-90 75,17.3 75,10.6 arc90 75.3,10.3 v77.5,10.3
  Bottom 0.152: U1.28 v10.11,17.75 arc32 v10.1,17.75 | v14.5,10.3 14.7,10.3 arc-90 15,10 15,9.5 arc90 15.3,9.2 U$5.P$12 | U5.28 v31.11,17.75 arc32 v31.1,17.75 | v35.5,10.3 35.7,10.3 arc-90 36,10 36,9.5 arc90 36.3,9.2 U$15.P$12 | U9.28 v52.11,17.75 arc32 v52.1,17.75 | v56.5,10.3 56.7,10.3 arc-90 57,10 57,9.5 arc90 57.3,9.2 U$25.P$12 | U13.28 v73.11,17.75 arc32 v73.1,17.75 | v77.5,10.3 77.7,10.3 arc-90 78,10 78,9.5 arc90 78.3,9.2 U$35.P$12
MOSI  (via drill 0.35)  (3 unrouted)
  Top 0.152: v11.5,15.5 11.5,10.5 arc90 12.2,9.8 13.6,9.8 arc-90 14.1,9.3 v14.1,7.7 | v32.5,15.5 32.5,10.5 arc90 33.2,9.8 34.6,9.8 arc-90 35.1,9.3 v35.1,7.7 | v53.5,15.5 53.5,10.5 arc90 54.2,9.8 55.6,9.8 arc-90 56.1,9.3 v56.1,7.7 | v74.5,15.5 74.5,10.5 arc90 75.2,9.8 76.6,9.8 arc-90 77.1,9.3 v77.1,7.7
  Bottom 0.152: U1.25 11.56,15.56 arc-90 v11.5,15.5 | U$5.P$8 15.3,7.6 arc90 15.2,7.5 arc-90 15.1,7.4 14.4,7.4 arc-90 v14.1,7.7 | U5.25 32.56,15.56 arc-90 v32.5,15.5 | U$15.P$8 36.3,7.6 arc90 36.2,7.5 arc-90 36.1,7.4 35.4,7.4 arc-90 v35.1,7.7 | U9.25 53.56,15.56 arc-90 v53.5,15.5 | U$25.P$8 57.3,7.6 arc90 57.2,7.5 arc-90 57.1,7.4 56.4,7.4 arc-90 v56.1,7.7 | U13.25 74.56,15.56 arc-90 v74.5,15.5 | U$35.P$8 78.3,7.6 arc90 78.2,7.5 arc-90 78.1,7.4 77.4,7.4 arc-90 v77.1,7.7
N$1  (via drill 0.35)
  Top 0.152: v18.44,23.78 18.05,23.78 arc93 17.4,23.09 17.4,21.4 arc-90 17.1,21.1 16.1,21.1 | C7.2 15.55,21.75 arc-90 15.7,21.6 15.7,21.5 arc90 16.1,21.1 | U$1.P$2 15.55,20.55 arc90 15.7,20.7 arc-90 16.1,21.1
  Bottom 0.152: U1.1 18.44,22.47 arc1 v18.44,23.78
N$2
  pour Bottom (no thermals): 3.3,6.6 3.3,2.6 2.9,2.2 0.9,2.2 0.4,2.7 0.4,10 1,10.6 3.6,10.6 3.6,6.9
N$3
  Bottom 0.152: R8.2 R5.2 4.1,10.9 arc90 4.3,10.7 4.4,10.7 arc-90 4.6,10.5 U$2.P$1
N$4  (via drill 0.35)
  Top 0.152: v19.2,23.2 18.1,23.2 arc90 17.9,23 17.9,20 arc-90 17.6,19.7 14.94,19.7 arc90 14.5,19.26 U$1.P$1 arc90 14.55,18 15,18 arc-90 15.08,17.92 C6.2
  Bottom 0.152: U1.2 18.96,21.25 arc92 19.2,21.5 v19.2,23.2
N$5
  Bottom 0.152: R7.2 1,1.02 1,1.71 arc-45 1.09,1.92 arc-45 1.29,2 1.88,2 arc45 2.09,2.09 2.09,2.09 arc45 2.18,2.3 R6.1 4,3 4.25,3 arc-90 4.52,2.73 R9.1
N$6
  Bottom 0.152: R11.1 8.9,8.58 | 8.9,8.58 R10.1 | 8.9,8.58 8.9,10.3 arc-90 9.4,10.8 R12.1
N$8
  Bottom 0.152: U1.43 15.25,24.15 arc90 14.9,24.5 14.7,24.5 arc-90 14.35,24.85 C5.2
N$9  (via drill 0.35)
  Top 0.152: R1.1 15.88,15.18 arc-90 16.1,15.4 17.5,15.4 arc90 17.7,15.6 | 17.7,15.6 arc90 17.9,15.4 18.2,15.4 arc-90 18.4,15.2 C3.2 | v19.3,19.25 19.3,18.7 arc-90 19,18.4 18,18.4 arc90 17.7,18.1 17.7,15.6
  Bottom 0.152: U1.6 v19.3,19.25
N$17
  pour Bottom (no thermals): 24.3,6.6 24.3,2.6 23.9,2.2 21.9,2.2 21.4,2.7 21.4,10 22,10.6 24.6,10.6 24.6,6.9
N$18
  Bottom 0.152: R28.2 R25.2 25.1,10.9 arc90 25.3,10.7 25.4,10.7 arc-90 25.6,10.5 U$11.P$1
N$19
  Bottom 0.152: R27.2 22,1.02 22,1.71 arc-45 22.09,1.92 arc-45 22.29,2 22.88,2 arc45 23.09,2.09 23.09,2.09 arc45 23.18,2.3 R26.1 25,3 25.25,3 arc-90 25.52,2.73 R29.1
N$20  (via drill 0.35)
  Top 0.152: v39.44,23.78 39.05,23.78 arc93 38.4,23.09 38.4,21.4 arc-90 38.1,21.1 37.1,21.1 | C27.2 36.55,21.75 arc-90 36.7,21.6 36.7,21.5 arc90 37.1,21.1 | U$12.P$2 36.55,20.55 arc90 36.7,20.7 arc-90 37.1,21.1
  Bottom 0.152: U5.1 39.44,22.47 arc1 v39.44,23.78
N$21  (via drill 0.35)
  Top 0.152: v40.2,23.2 39.1,23.2 arc90 38.9,23 38.9,20 arc-90 38.6,19.7 35.94,19.7 arc90 35.5,19.26 U$12.P$1 arc90 35.55,18 36,18 arc-90 36.08,17.92 C26.2
  Bottom 0.152: U5.2 39.96,21.25 arc92 40.2,21.5 v40.2,23.2
N$22
  Bottom 0.152: U5.43 36.25,24.15 arc90 35.9,24.5 35.7,24.5 arc-90 35.35,24.85 C25.2
N$23  (via drill 0.35)
  Top 0.152: R30.1 36.88,15.18 arc-90 37.1,15.4 38.5,15.4 arc90 38.7,15.6 | 38.7,15.6 arc90 38.9,15.4 39.2,15.4 arc-90 39.4,15.2 C23.2 | v40.3,19.25 40.3,18.7 arc-90 40,18.4 39,18.4 arc90 38.7,18.1 38.7,15.6
  Bottom 0.152: U5.6 v40.3,19.25
N$24
  Bottom 0.152: R35.1 29.9,8.58 | 29.9,8.58 R34.1 | 29.9,8.58 29.9,10.3 arc-90 30.4,10.8 R36.1
N$33
  pour Bottom (no thermals): 45.3,6.6 45.3,2.6 44.9,2.2 42.9,2.2 42.4,2.7 42.4,10 43,10.6 45.6,10.6 45.6,6.9
N$34
  Bottom 0.152: R52.2 R49.2 46.1,10.9 arc90 46.3,10.7 46.4,10.7 arc-90 46.6,10.5 U$21.P$1
N$35
  Bottom 0.152: R51.2 43,1.02 43,1.71 arc-45 43.09,1.92 arc-45 43.29,2 43.88,2 arc45 44.09,2.09 44.09,2.09 arc45 44.18,2.3 R50.1 46.25,3 arc-90 46.52,2.73 R53.1
N$36  (via drill 0.35)
  Top 0.152: v60.44,23.78 60.05,23.78 arc93 59.4,23.09 59.4,21.4 arc-90 59.1,21.1 58.1,21.1 | C47.2 57.55,21.75 arc-90 57.7,21.6 57.7,21.5 arc90 58.1,21.1 | U$22.P$2 57.55,20.55 arc90 57.7,20.7 arc-90 58.1,21.1
  Bottom 0.152: U9.1 60.44,22.47 arc1 v60.44,23.78
N$37  (via drill 0.35)
  Top 0.152: v61.2,23.2 60.1,23.2 arc90 59.9,23 59.9,20 arc-90 59.6,19.7 56.94,19.7 arc90 56.5,19.26 U$22.P$1 arc90 56.55,18 57,18 arc-90 57.08,17.92 C46.2
  Bottom 0.152: U9.2 60.96,21.25 arc92 61.2,21.5 v61.2,23.2
N$38
  Bottom 0.152: U9.43 57.25,24.15 arc90 56.9,24.5 56.7,24.5 arc-90 56.35,24.85 C45.2
N$39  (via drill 0.35)
  Top 0.152: R54.1 57.88,15.18 arc-90 58.1,15.4 59.5,15.4 arc90 59.7,15.6 | 59.7,15.6 arc90 59.9,15.4 60.2,15.4 arc-90 60.4,15.2 C43.2 | v61.3,19.25 61.3,18.7 arc-90 61,18.4 60,18.4 arc90 59.7,18.1 59.7,15.6
  Bottom 0.152: U9.6 v61.3,19.25
N$40
  Bottom 0.152: R59.1 50.9,8.58 | 50.9,8.58 R58.1 | 50.9,8.58 50.9,10.3 arc-90 51.4,10.8 R60.1
N$49
  pour Bottom (no thermals): 66.3,6.6 66.3,2.6 65.9,2.2 63.9,2.2 63.4,2.7 63.4,10 64,10.6 66.6,10.6 66.6,6.9
N$50
  Bottom 0.152: R76.2 R73.2 67.1,10.9 arc90 67.3,10.7 67.4,10.7 arc-90 67.6,10.5 U$31.P$1
N$51
  Bottom 0.152: R75.2 64,1.02 64,1.71 arc-45 64.09,1.92 arc-45 64.29,2 64.88,2 arc45 65.09,2.09 65.09,2.09 arc45 65.18,2.3 R74.1 67.25,3 arc-90 67.52,2.73 R77.1
N$52  (via drill 0.35)
  Top 0.152: v81.44,23.78 81.05,23.78 arc93 80.4,23.09 80.4,21.4 arc-90 80.1,21.1 79.1,21.1 | C67.2 78.55,21.75 arc-90 78.7,21.6 78.7,21.5 arc90 79.1,21.1 | U$32.P$2 78.55,20.55 arc90 78.7,20.7 arc-90 79.1,21.1
  Bottom 0.152: U13.1 81.44,22.47 arc1 v81.44,23.78
N$53  (via drill 0.35)
  Top 0.152: v82.2,23.2 81.1,23.2 arc90 80.9,23 80.9,20 arc-90 80.6,19.7 77.94,19.7 arc90 77.5,19.26 U$32.P$1 arc90 77.55,18 78,18 arc-90 78.08,17.92 C66.2
  Bottom 0.152: U13.2 81.96,21.25 arc92 82.2,21.5 v82.2,23.2
N$54
  Bottom 0.152: U13.43 78.25,24.15 arc90 77.9,24.5 77.7,24.5 arc-90 77.35,24.85 C65.2
N$55  (via drill 0.35)
  Top 0.152: R78.1 78.88,15.18 arc-90 79.1,15.4 80.5,15.4 arc90 80.7,15.6 | 80.7,15.6 arc90 80.9,15.4 81.2,15.4 arc-90 81.4,15.2 C63.2 | v82.3,19.25 82.3,18.7 arc-90 82,18.4 81,18.4 arc90 80.7,18.1 80.7,15.6
  Bottom 0.152: U13.6 v82.3,19.25
N$56
  Bottom 0.152: R83.1 71.9,8.58 | 71.9,8.58 R82.1 | 71.9,8.58 71.9,10.3 arc-90 72.4,10.8 R84.1
PY1  (via drill 0.35)  (3 unrouted)
  Top 0.152: v10,14.5 3.8,14.5 arc90 2.9,13.6 v2.9,12.2 | v31,14.5 24.8,14.5 arc90 23.9,13.6 v23.9,12.2 | v52,14.5 45.8,14.5 arc90 44.9,13.6 v44.9,12.2 | v73,14.5 66.8,14.5 arc90 65.9,13.6 v65.9,12.2
  Bottom 0.152: R8.1 2.72,12.78 arc-90 2.9,12.6 v2.9,12.2 | U1.24 12.25,14.81 arc-97 11.9,14.5 v10,14.5 | R28.1 23.72,12.78 arc-90 23.9,12.6 v23.9,12.2 | U5.24 33.25,14.81 arc-97 32.9,14.5 v31,14.5 | R52.1 44.72,12.78 arc-90 44.9,12.6 v44.9,12.2 | U9.24 54.25,14.81 arc-97 53.9,14.5 v52,14.5 | R76.1 65.72,12.78 arc-90 65.9,12.6 v65.9,12.2 | U13.24 75.25,14.81 arc-97 74.9,14.5 v73,14.5
RESET  (via drill 0.5)  (3 unrouted)
  Top 0.152: U$4.2 16.5,22.8 arc90 16.1,23.2 14.1,23.2 arc-90 13.75,23.55 v13.75,23.89 R4.1 | U$14.2 37.5,22.8 arc90 37.1,23.2 35.1,23.2 arc-90 34.75,23.55 v34.75,23.89 R33.1 | U$24.2 58.5,22.8 arc90 58.1,23.2 56.1,23.2 arc-90 55.75,23.55 v55.75,23.89 R57.1 | U$34.2 79.5,22.8 arc90 79.1,23.2 77.1,23.2 arc-90 76.75,23.55 v76.75,23.89 R81.1
  Bottom 0.152: U1.40 v13.75,23.89 | U5.40 v34.75,23.89 | U9.40 v55.75,23.89 | U13.40 v76.75,23.89
RX  (3 unrouted)
SCL  (via drill 0.35)  (3 unrouted)
  Top 0.152: v7.2,26 7.2,20.9 arc90 7.8,20.3 v9.1,20.3 9.1,22.9 arc90 8.9,23.1 8.35,23.1 arc-90 R2.1 | v28.2,26 28.2,20.9 arc90 28.8,20.3 v30.1,20.3 30.1,22.9 arc90 29.9,23.1 29.35,23.1 arc-90 R31.1 | v49.2,26 49.2,20.9 arc90 49.8,20.3 v51.1,20.3 51.1,22.9 arc90 50.9,23.1 50.35,23.1 arc-90 R55.1 | v70.2,26 70.2,20.9 arc90 70.8,20.3 v72.1,20.3 72.1,22.9 arc90 71.9,23.1 71.35,23.1 arc-90 R79.1
  Bottom 0.152: U3.8 6.1,25.7 arc-90 6.4,26 v7.2,26 | U1.32 10.25,19.75 arc-90 10,20 arc90 9.7,20.3 v9.1,20.3 | U6.8 27.1,25.7 arc-90 27.4,26 v28.2,26 | U5.32 31.25,19.75 arc-90 31,20 arc90 30.7,20.3 v30.1,20.3 | U10.8 48.1,25.7 arc-90 48.4,26 v49.2,26 | U9.32 52.25,19.75 arc-90 52,20 arc90 51.7,20.3 v51.1,20.3 | U14.8 69.1,25.7 arc-90 69.4,26 v70.2,26 | U13.32 73.25,19.75 arc-90 73,20 arc90 72.7,20.3 v72.1,20.3
SD_CS  (via drill 0.35)  (3 unrouted)
  Top 0.152: v10.7,17.25 10.7,16.5 arc-90 10.6,16.4 arc90 10.5,16.3 10.5,7.64 arc90 11.24,6.9 v14.7,6.9 | v31.7,17.25 31.7,16.5 arc-90 31.6,16.4 arc90 31.5,16.3 31.5,7.64 arc90 32.24,6.9 v35.7,6.9 | v52.7,17.25 52.7,16.5 arc-90 52.6,16.4 arc90 52.5,16.3 52.5,7.64 arc90 53.24,6.9 v56.7,6.9 | v73.7,17.25 73.7,16.5 arc-90 73.6,16.4 arc90 73.5,16.3 73.5,7.64 arc90 74.24,6.9 v77.7,6.9
  Bottom 0.152: v10.7,17.25 U1.27 | v14.7,6.9 15.2,6.9 arc90 15.3,7 arc-90 15.5,7.2 U$5.P$7 | v31.7,17.25 U5.27 | v35.7,6.9 36.2,6.9 arc90 36.3,7 arc-90 36.5,7.2 U$15.P$7 | v52.7,17.25 U9.27 | v56.7,6.9 57.2,6.9 arc90 57.3,7 arc-90 57.5,7.2 U$25.P$7 | v73.7,17.25 U13.27 | v77.7,6.9 78.2,6.9 arc90 78.3,7 arc-90 78.5,7.2 U$35.P$7
SDA  (via drill 0.35)  (3 unrouted)
  Top 0.152: 6.05,23 arc90 R3.1 arc-90 6.05,23 | 6.05,23 v5.1,23 | 27.05,23 arc90 R32.1 arc-90 27.05,23 | 27.05,23 v26.1,23 | 48.05,23 arc90 R56.1 arc90 48.05,23 | 48.05,23 v47.1,23 | 69.05,23 arc90 R80.1 arc90 69.05,23 | 69.05,23 v68.1,23
  Bottom 0.152: U1.31 11.46,19.25 11.46,19.24 9.9,19.24 arc-51 9.2,19.6 arc52 8.6,19.9 arc1 5.7,19.9 arc-91 5.1,20.5 arc1 5.1,20.7 arc-1 5.1,21.2 v5.1,23 5.1,23.4 arc-90 5.3,23.6 6.08,23.6 arc90 U3.7 | U5.31 32.47,19.25 32.45,19.24 30.9,19.24 arc-51 30.2,19.6 arc52 29.6,19.9 arc1 26.7,19.9 arc-91 26.1,20.5 arc1 26.1,20.7 arc-1 26.1,21.2 v26.1,23 26.1,23.4 arc-90 26.3,23.6 27.07,23.6 arc90 U6.7 | U9.31 53.47,19.25 53.45,19.24 51.9,19.24 arc-51 51.2,19.6 arc52 50.6,19.9 arc1 47.7,19.9 arc-91 47.1,20.5 arc1 47.1,20.7 arc-1 47.1,21.2 v47.1,23 47.1,23.4 arc-90 47.3,23.6 48.08,23.6 arc90 U10.7 | U13.31 74.47,19.25 74.45,19.24 72.9,19.24 arc-51 72.2,19.6 arc52 71.6,19.9 arc1 68.7,19.9 arc-91 68.1,20.5 arc1 68.1,20.7 arc-1 68.1,21.2 v68.1,23 68.1,23.4 arc-90 68.3,23.6 69.08,23.6 arc90 U14.7
SWCLK  (via drill 1)  (3 unrouted)
  Bottom 0.152: U1.45 16.25,24.75 arc33 v16,25 | U5.45 37.25,24.75 arc33 v37,25 | U9.45 58.25,24.75 arc33 v58,25 | U13.45 79.25,24.75 arc33 v79,25
SWDIO  (via drill 1)  (3 unrouted)
  Bottom 0.152: U1.46 16.75,23.75 arc-90 18,25 v19,25 | U5.46 37.75,23.75 arc-90 39,25 v40,25 | U9.46 58.75,23.75 arc-90 60,25 v61,25 | U13.46 79.75,23.75 arc-90 81,25 v82,25
TX  (3 unrouted)
VOLT  (via drill 0.35)  (3 unrouted)
  Top 0.152: v16.7,12.7 16.7,11.6 arc-90 15.9,10.8 v12.5,10.8 | v37.7,12.7 37.7,11.6 arc-90 36.9,10.8 v33.5,10.8 | v58.7,12.7 58.7,11.6 arc-90 57.9,10.8 v54.5,10.8 | v79.7,12.7 79.7,11.6 arc-90 78.9,10.8 v75.5,10.8
  Bottom 0.152: U1.10 19.05,17.25 arc-90 19.3,17 19.3,13.5 arc-90 18.5,12.7 v16.7,12.7 | R12.2 v12.5,10.8 | U5.10 40.05,17.25 arc-90 40.3,17 40.3,13.5 arc-90 39.5,12.7 v37.7,12.7 | R36.2 v33.5,10.8 | U9.10 61.05,17.25 arc-90 61.3,17 61.3,13.5 arc-90 60.5,12.7 v58.7,12.7 | R60.2 v54.5,10.8 | U13.10 82.05,17.25 arc-90 82.3,17 82.3,13.5 arc-90 81.5,12.7 v79.7,12.7 | R84.2 v75.5,10.8